# Altium project SixSwitchRectifier.PrjPcb (part 1 of 2)
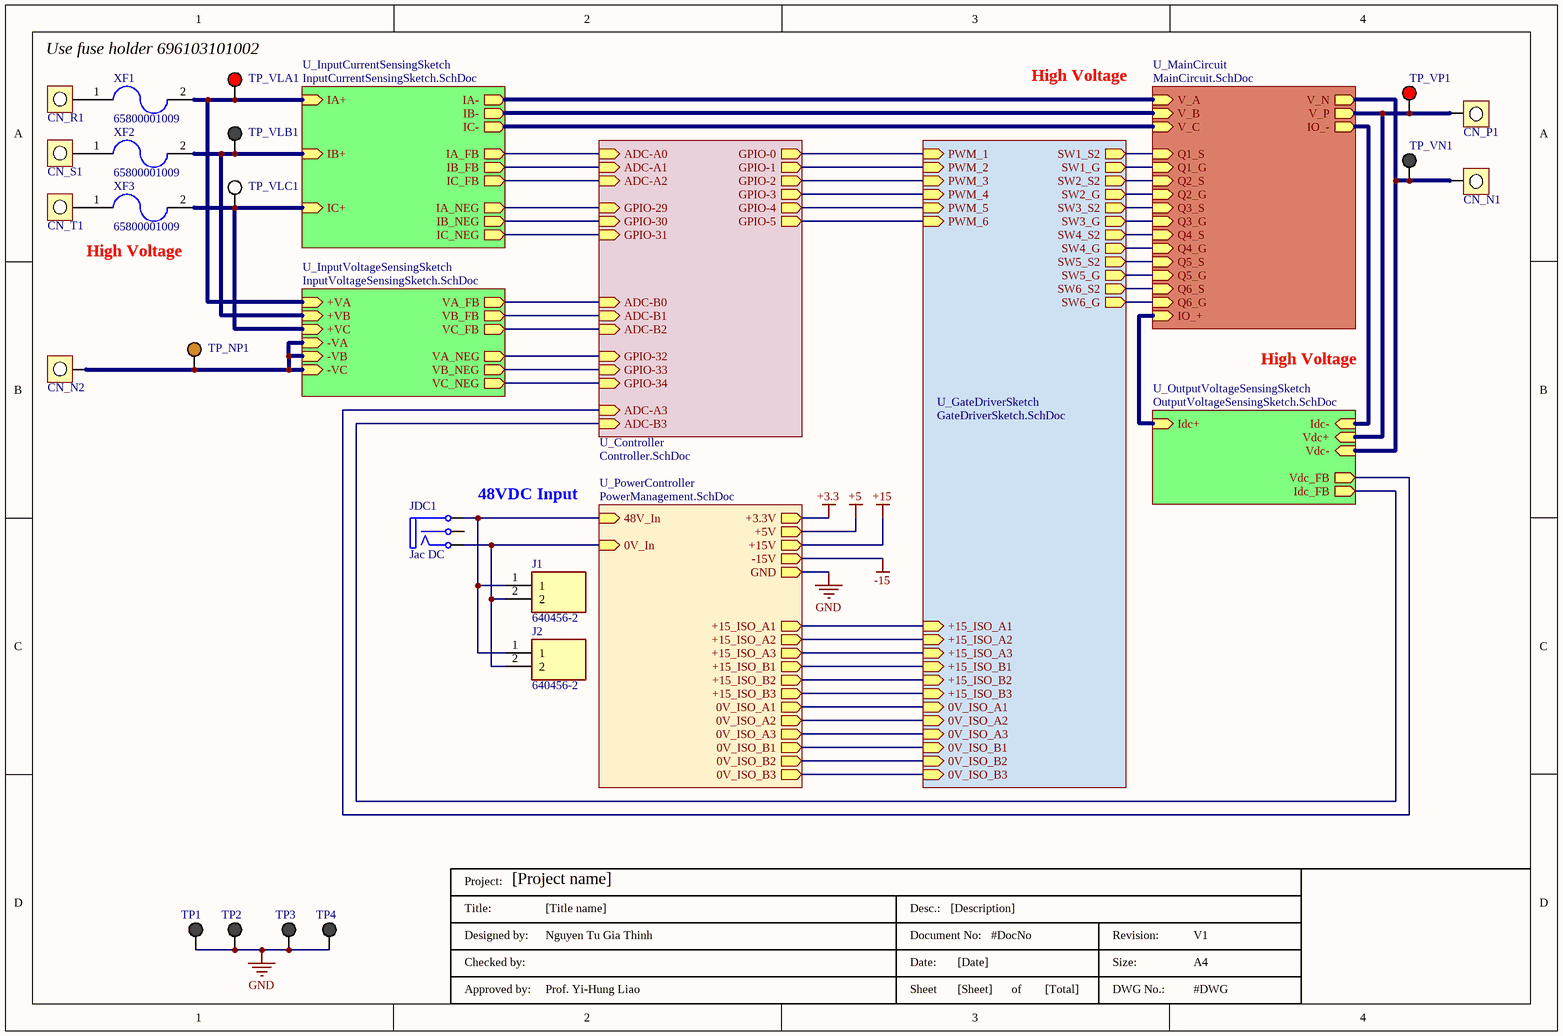
[diagram p0: CoverSheet.SchDoc]
8 sheets, 314 parts. Net scope: hierarchical (ports join the sheet entries above them; power ports are global).
Board file: SixSwitchRectifier_Board.PcbDoc
Sheets:
  CoverSheet.SchDoc
    U_PowerController = PowerManagement.SchDoc
    U_InputVoltageSensingSketch = InputVoltageSensingSketch.SchDoc
    U_InputCurrentSensingSketch = InputCurrentSensingSketch.SchDoc
    U_OutputVoltageSensingSketch = OutputVoltageSensingSketch.SchDoc
    U_GateDriverSketch = GateDriverSketch.SchDoc
    U_MainCircuit = MainCircuit.SchDoc
    U_Controller = Controller.SchDoc

## Sheet CoverSheet.SchDoc
size A4; SheetNumber: 1; SheetTotal: 8

### Parts
(Parts that share a designator on the sheet are numbered #1, #2 ... from top to bottom, then left to right.)
CN_N1  CN  [P-820W]  (value not drawn)
CN_N2  CN  [P-820W]  (value not drawn)
CN_P1  CN  [P-820W]  (value not drawn)
CN_R1  CN  [P-820W]  (value not drawn)
CN_S1  CN  [P-820W]  (value not drawn)
CN_T1  CN  [P-820W]  (value not drawn)
J1  640456-2  [SHDR2W66P0X254_1X2_508X572X1041P]
J2  640456-2  [SHDR2W66P0X254_1X2_508X572X1041P]
JDC1  Jac DC  [DC-IN]
TitleBlock#1  DWG No.: #DWG  Size:: A4  Revision:: V1  Total of Sheets: [Total]  Sheet: [Sheet]  Date:: [Date]  Document No:: #DocNo  Desc.:: [Description]  Approved by:: Prof. Yi-Hung Liao  Designed by:: Nguyen Tu Gia Thinh  Title:: [Title name]  Project: [Project name]  (hidden comment: TitleBlock)  (graphical)
TP1  (no value)  [5001]
TP2  (no value)  [5001]
TP3  (no value)  [5001]
TP4  (no value)  [5001]
TP_NP1  (no value)  [5003]
TP_VLA1  (no value)  [5000]
TP_VLB1  (no value)  [5001]
TP_VLC1  (no value)  [5002]
TP_VN1  (no value)  [5001]
TP_VP1  (no value)  [5000]
XF1  65800001009  [FUSM250108X1320N]
XF2  65800001009  [FUSM250108X1320N]
XF3  65800001009  [FUSM250108X1320N]

### Sub-sheets
U_Controller = Controller.SchDoc: ADC-A0 (in), ADC-A1 (in), ADC-A2 (in), ADC-A3 (in), GPIO-0 (out), GPIO-1 (out), GPIO-2 (out), GPIO-3 (out), GPIO-4 (out), GPIO-5 (out), ADC-B0 (in), ADC-B1 (in), ADC-B2 (in), ADC-B3 (in), GPIO-29 (in), GPIO-30 (in), GPIO-31 (in), GPIO-32 (in), GPIO-33 (in), GPIO-34 (in)
U_GateDriverSketch = GateDriverSketch.SchDoc: SW1_G (out), SW2_G (out), SW1_S2 (out), SW2_S2 (out), PWM_1 (in), PWM_2 (in), SW3_G (out), SW4_G (out), SW3_S2 (out), SW4_S2 (out), PWM_3 (in), PWM_4 (in), SW5_G (out), SW6_G (out), SW5_S2 (out), SW6_S2 (out), PWM_5 (in), PWM_6 (in), 0V_ISO_A1 (in), +15_ISO_A1 (in), +15_ISO_B1 (in), +15_ISO_A2 (in), +15_ISO_B2 (in), +15_ISO_A3 (in), +15_ISO_B3 (in), 0V_ISO_B1 (in), 0V_ISO_A2 (in), 0V_ISO_B2 (in), 0V_ISO_A3 (in), 0V_ISO_B3 (in)
U_InputCurrentSensingSketch = InputCurrentSensingSketch.SchDoc: IA- (out), IB- (out), IC- (out), IA+ (in), IB+ (in), IA_FB (out), IB_FB (out), IC_FB (out), IC+ (in), IA_NEG (out), IB_NEG (out), IC_NEG (out)
U_InputVoltageSensingSketch = InputVoltageSensingSketch.SchDoc: +VA (in), -VA (in), +VB (in), -VB (in), +VC (in), -VC (in), VA_FB (out), VB_FB (out), VC_FB (out), VA_NEG (out), VB_NEG (out), VC_NEG (out)
U_MainCircuit = MainCircuit.SchDoc: V_A (in), V_B (in), V_C (in), V_N (out), V_P (out), IO_- (out), IO_+ (in), Q1_G (in), Q2_G (in), Q3_G (in), Q6_G (in), Q5_G (in), Q4_G (in), Q1_S (in), Q2_S (in), Q3_S (in), Q6_S (in), Q5_S (in), Q4_S (in)
U_OutputVoltageSensingSketch = OutputVoltageSensingSketch.SchDoc: Vdc+ (in), Vdc- (in), Idc+ (in), Idc- (in), Vdc_FB (out), Idc_FB (out)
U_PowerController = PowerManagement.SchDoc: +15V (out), -15V (out), +3.3V (out), 48V_In (in), 0V_In (in), +5V (out), GND (out), +15_ISO_A1 (out), 0V_ISO_A1 (out), 0V_ISO_B1 (out), 0V_ISO_A2 (out), 0V_ISO_B2 (out), 0V_ISO_B3 (out), 0V_ISO_A3 (out), +15_ISO_A2 (out), +15_ISO_A3 (out), +15_ISO_B3 (out), +15_ISO_B2 (out), +15_ISO_B1 (out)

### Nets
0V_In: J1.2 J2.2 JDC1.2(TN) ; sheet U_PowerController/0V_In
0V_ISO_A1: sheet U_PowerController/0V_ISO_A1, sheet U_GateDriverSketch/SW1_S2, sheet U_GateDriverSketch/0V_ISO_A1, sheet U_MainCircuit/Q1_S
0V_ISO_A2: sheet U_PowerController/0V_ISO_A2, sheet U_GateDriverSketch/SW3_S2, sheet U_GateDriverSketch/0V_ISO_A2, sheet U_MainCircuit/Q3_S
0V_ISO_A3: sheet U_PowerController/0V_ISO_A3, sheet U_GateDriverSketch/SW5_S2, sheet U_GateDriverSketch/0V_ISO_A3, sheet U_MainCircuit/Q5_S
0V_ISO_B1: sheet U_PowerController/0V_ISO_B1, sheet U_GateDriverSketch/SW2_S2, sheet U_GateDriverSketch/0V_ISO_B1, sheet U_MainCircuit/Q2_S
0V_ISO_B2: sheet U_PowerController/0V_ISO_B2, sheet U_GateDriverSketch/SW4_S2, sheet U_GateDriverSketch/0V_ISO_B2, sheet U_MainCircuit/Q4_S
0V_ISO_B3: sheet U_PowerController/0V_ISO_B3, sheet U_GateDriverSketch/SW6_S2, sheet U_GateDriverSketch/0V_ISO_B3, sheet U_MainCircuit/Q6_S
+15_ISO_A1: sheet U_PowerController/+15_ISO_A1, sheet U_GateDriverSketch/+15_ISO_A1
+15_ISO_A3: sheet U_PowerController/+15_ISO_A3, sheet U_GateDriverSketch/+15_ISO_A3
+15_ISO_B1: sheet U_PowerController/+15_ISO_B1, sheet U_GateDriverSketch/+15_ISO_B1
+15_ISO_B2: sheet U_PowerController/+15_ISO_B2, sheet U_GateDriverSketch/+15_ISO_B2
+15_ISO_B3: sheet U_PowerController/+15_ISO_B3, sheet U_GateDriverSketch/+15_ISO_B3
+48V_In: J1.1 J2.1 JDC1.1(T) ; sheet U_PowerController/48V_In
GND: TP1.1 TP2.1 TP3.1 TP4.1 ; sheet U_PowerController/GND
ADC-A0: sheet U_InputCurrentSensingSketch/IA_FB, sheet U_Controller/ADC-A0
ADC-A1: sheet U_InputCurrentSensingSketch/IB_FB, sheet U_Controller/ADC-A1
ADC-A2: sheet U_InputCurrentSensingSketch/IC_FB, sheet U_Controller/ADC-A2
ADC-A3: sheet U_OutputVoltageSensingSketch/Vdc_FB, sheet U_Controller/ADC-A3
ADC-B0: sheet U_InputVoltageSensingSketch/VA_FB, sheet U_Controller/ADC-B0
ADC-B1: sheet U_InputVoltageSensingSketch/VB_FB, sheet U_Controller/ADC-B1
ADC-B2: sheet U_InputVoltageSensingSketch/VC_FB, sheet U_Controller/ADC-B2
ADC-B3: sheet U_OutputVoltageSensingSketch/Idc_FB, sheet U_Controller/ADC-B3
GPIO-0: sheet U_GateDriverSketch/PWM_1, sheet U_Controller/GPIO-0
GPIO-1: sheet U_GateDriverSketch/PWM_2, sheet U_Controller/GPIO-1
GPIO-2: sheet U_GateDriverSketch/PWM_3, sheet U_Controller/GPIO-2
GPIO-3: sheet U_GateDriverSketch/PWM_4, sheet U_Controller/GPIO-3
GPIO-4: sheet U_GateDriverSketch/PWM_5, sheet U_Controller/GPIO-4
GPIO-5: sheet U_GateDriverSketch/PWM_6, sheet U_Controller/GPIO-5
GPIO-29: sheet U_InputCurrentSensingSketch/IA_NEG, sheet U_Controller/GPIO-29
GPIO-30: sheet U_InputCurrentSensingSketch/IB_NEG, sheet U_Controller/GPIO-30
GPIO-31: sheet U_InputCurrentSensingSketch/IC_NEG, sheet U_Controller/GPIO-31
GPIO-32: sheet U_InputVoltageSensingSketch/VA_NEG, sheet U_Controller/GPIO-32
GPIO-33: sheet U_InputVoltageSensingSketch/VB_NEG, sheet U_Controller/GPIO-33
GPIO-34: sheet U_InputVoltageSensingSketch/VC_NEG, sheet U_Controller/GPIO-34
NetC36_1: sheet U_PowerController/+15_ISO_A2, sheet U_GateDriverSketch/+15_ISO_A2
NetC47_1: sheet U_OutputVoltageSensingSketch/Idc+, sheet U_MainCircuit/IO_+
NetC47_2: CN_N1.1 TP_VN1.1 ; sheet U_OutputVoltageSensingSketch/Vdc-, sheet U_MainCircuit/V_N
NetCN_N2_1: CN_N2.1 TP_NP1.1 ; sheet U_InputVoltageSensingSketch/-VA, sheet U_InputVoltageSensingSketch/-VB, sheet U_InputVoltageSensingSketch/-VC
NetCN_P1_1: CN_P1.1 TP_VP1.1 ; sheet U_OutputVoltageSensingSketch/Vdc+, sheet U_OutputVoltageSensingSketch/Idc-, sheet U_MainCircuit/V_P, sheet U_MainCircuit/IO_-
NetCN_R1_1: CN_R1.1 XF1.1
NetCN_S1_1: CN_S1.1 XF2.1
NetCN_T1_1: CN_T1.1 XF3.1
NetD1_2: sheet U_GateDriverSketch/SW1_G, sheet U_MainCircuit/Q1_G
NetD2_2: sheet U_GateDriverSketch/SW2_G, sheet U_MainCircuit/Q2_G
NetD3_2: sheet U_GateDriverSketch/SW3_G, sheet U_MainCircuit/Q3_G
NetD4_2: sheet U_GateDriverSketch/SW4_G, sheet U_MainCircuit/Q4_G
NetD5_2: sheet U_GateDriverSketch/SW5_G, sheet U_MainCircuit/Q5_G
NetD6_2: sheet U_GateDriverSketch/SW6_G, sheet U_MainCircuit/Q6_G
NetL10_1: sheet U_InputCurrentSensingSketch/IA-, sheet U_MainCircuit/V_A
NetL11_1: sheet U_InputCurrentSensingSketch/IB-, sheet U_MainCircuit/V_B
NetL12_1: sheet U_InputCurrentSensingSketch/IC-, sheet U_MainCircuit/V_C
NetR53_1: TP_VLA1.1 XF1.2 ; sheet U_InputVoltageSensingSketch/+VA, sheet U_InputCurrentSensingSketch/IA+
NetR66_1: TP_VLB1.1 XF2.2 ; sheet U_InputVoltageSensingSketch/+VB, sheet U_InputCurrentSensingSketch/IB+
NetR79_1: TP_VLC1.1 XF3.2 ; sheet U_InputVoltageSensingSketch/+VC, sheet U_InputCurrentSensingSketch/IC+

Not connected (* = marked no-connect by the designer): JDC1 3(S)

### Notes on the sheet
- Use fuse holder 696103101002
- High Voltage
- (near JDC1) 48VDC Input
- (in symbol Title Block 2) Project:; Title:; Desc.:; Designed by:; Document No:; Revision:; Checked by:; Date:; Size:; Approved by:; Sheet; of; DWG No.:

### Library data of the parts
CN_N1 CN_N2 CN_P1 CN_R1 CN_S1 CN_T1 = CN: Terminal
J1 J2 = 640456-2: Connector; Manufacturer_Name: TE Connectivity; Datasheet Link: http://www.te.com/commerce/DocumentDelivery/DDEController?Action=showdoc&DocId=Customer+Drawing%7F640456%7FW3%7Fpdf%7FEnglish%7FENG_CD_640456_W3.pdf%7F640456-2; Height: 10.414mm; Manufacturer_Part_Number: 640456-2; Mouser Part Number: 571-6404562; Mouser Price/Stock: https://www.mouser.co.uk/ProductDetail/TE-Connectivity-AMP/640456-2?qs=%2F35zJ5USjomRu3EJQJgZCQ%3D%3D; Arrow Part Number: 640456-2; Arrow Price/Stock: https://www.arrow.com/en/products/640456-2/te-connectivity?utm_currency=USD&region=europe
JDC1 = DCIN: Jac DC input; Value: Jac DC
TitleBlock#1 = Title Block 2
TP1-TP4 TP_VLB1 TP_VN1 = 5001: Test Point Black, Multipurpose, TH
TP_NP1 = 5003: Test Point Orrange, Multipurpose, TH
TP_VLA1 TP_VP1 = 5000: Test Point Red, Multipurpose, TH
TP_VLC1 = 5002: Test Point White, Multipurpose, TH
XF1-XF3 = 65800001009: Hardware; Manufacturer_Name: LITTELFUSE; Datasheet Link: https://www.littelfuse.com/media?resourcetype=datasheets&itemid=7143dbe7-66cc-46d0-a668-04c7d18969fc&filename=littelfuse-fuse-block-656-datasheet; Height: 13.2mm; Manufacturer_Part_Number: 65800001009; Mouser Part Number: 576-65800001009; Mouser Price/Stock: https://www.mouser.co.uk/ProductDetail/Littelfuse/65800001009?qs=sU0fTKI0LumNKe7EsrMdwQ%3D%3D; Arrow Part Number: 65800001009; Arrow Price/Stock: https://www.arrow.com/en/products/65800001009/littelfuse?utm_currency=USD&region=nac

## Sheet PowerManagement.SchDoc
size A4; SheetNumber: 7; SheetTotal: 8
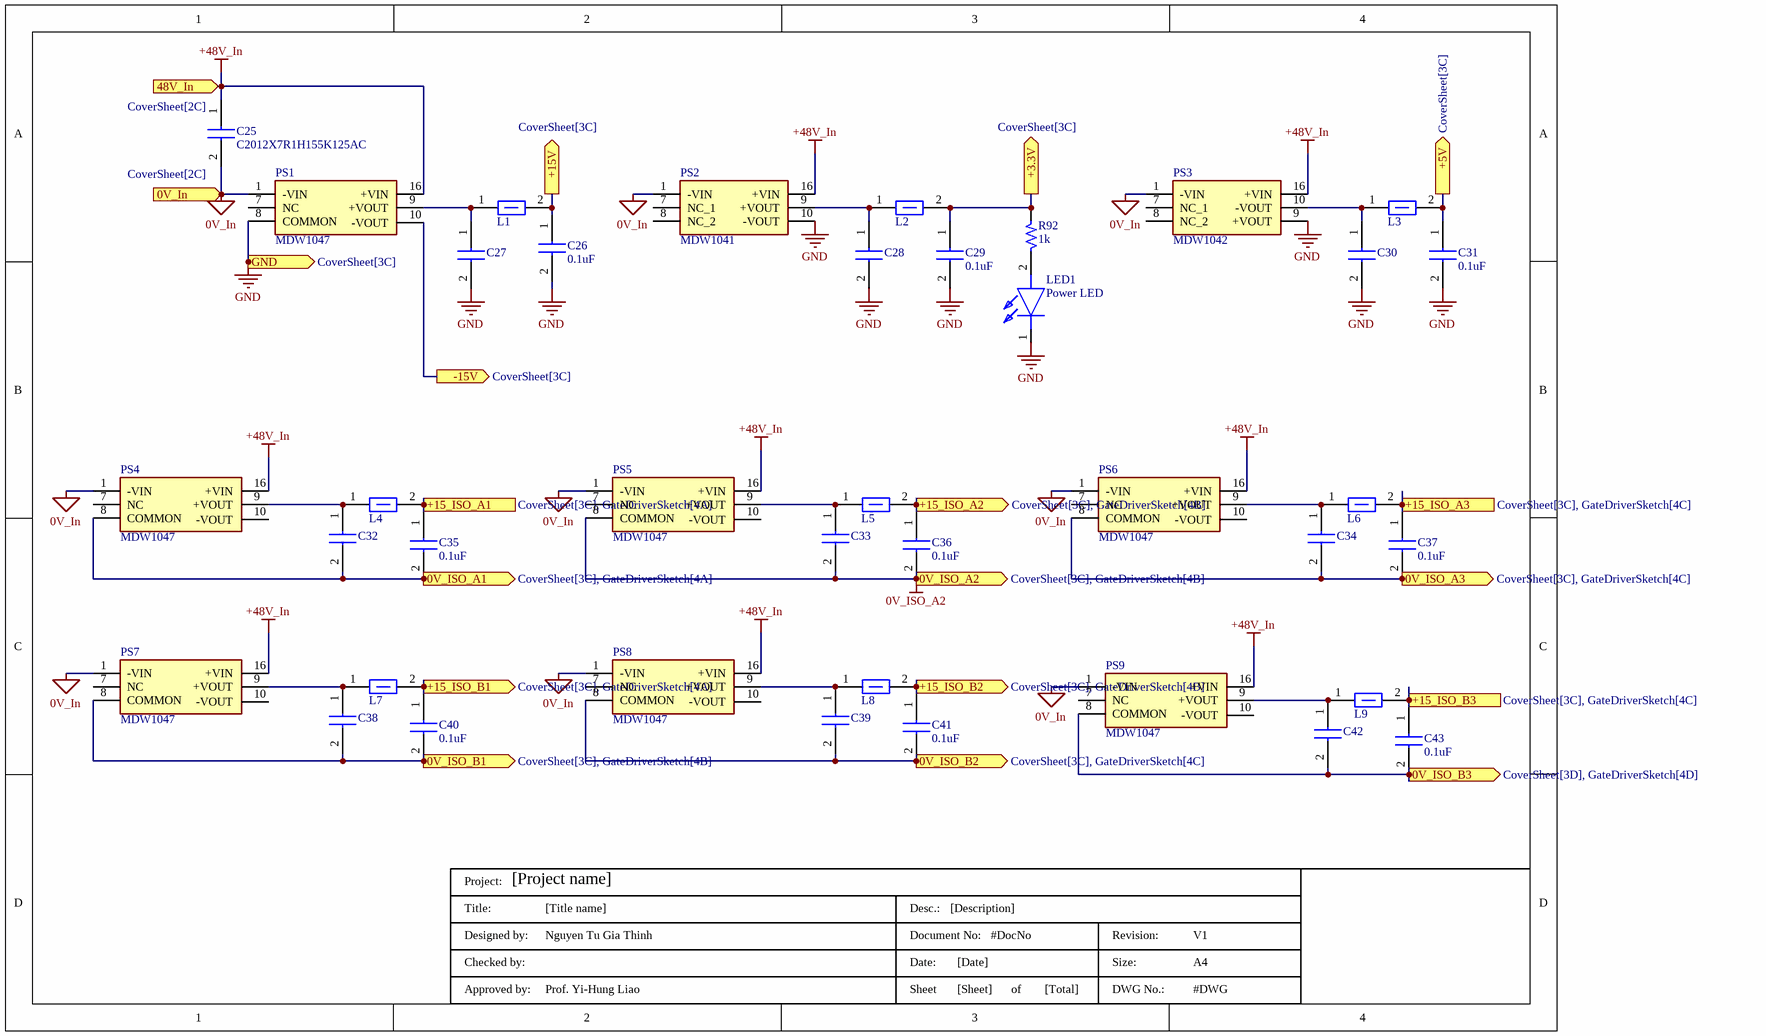
[diagram p1: PowerManagement.SchDoc]

### Parts
(Parts that share a designator on the sheet are numbered #1, #2 ... from top to bottom, then left to right.)
C25  C2012X7R1H155K125AC  [CAPC2012X145N]
C26  0.1uF  [C0805]
C27  CGA4J1X7R1E335K125AC  [CAPC2012X145N]  (value not drawn)
C28  CGA4J1X7R1E335K125AC  [CAPC2012X145N]  (value not drawn)
C29  0.1uF  [C0805]
C30  CGA4J1X7R1E335K125AC  [CAPC2012X145N]  (value not drawn)
C31  0.1uF  [C0805]
C32  CGA4J1X7R1E335K125AC  [CAPC2012X145N]  (value not drawn)
C33  CGA4J1X7R1E335K125AC  [CAPC2012X145N]  (value not drawn)
C34  CGA4J1X7R1E335K125AC  [CAPC2012X145N]  (value not drawn)
C35  0.1uF  [C0805]
C36  0.1uF  [C0805]
C37  0.1uF  [C0805]
C38  CGA4J1X7R1E335K125AC  [CAPC2012X145N]  (value not drawn)
C39  CGA4J1X7R1E335K125AC  [CAPC2012X145N]  (value not drawn)
C40  0.1uF  [C0805]
C41  0.1uF  [C0805]
C42  CGA4J1X7R1E335K125AC  [CAPC2012X145N]  (value not drawn)
C43  0.1uF  [C0805]
L1  MPZ2012S300A  [BEADC2012X105N]  (value not drawn)
L2  MPZ2012S300A  [BEADC2012X105N]  (value not drawn)
L3  MPZ2012S300A  [BEADC2012X105N]  (value not drawn)
L4  MPZ2012S300A  [BEADC2012X105N]  (value not drawn)
L5  MPZ2012S300A  [BEADC2012X105N]  (value not drawn)
L6  MPZ2012S300A  [BEADC2012X105N]  (value not drawn)
L7  MPZ2012S300A  [BEADC2012X105N]  (value not drawn)
L8  MPZ2012S300A  [BEADC2012X105N]  (value not drawn)
L9  MPZ2012S300A  [BEADC2012X105N]  (value not drawn)
LED1  Power LED  [LEDC2012X80N]
PS1  MDW1047  [MDEU0205D12HI]
PS2  MDW1041  [MDEU0205D12HI]
PS3  MDW1042  [MDEU0205D12HI]
PS4  MDW1047  [MDEU0205D12HI]
PS5  MDW1047  [MDEU0205D12HI]
PS6  MDW1047  [MDEU0205D12HI]
PS7  MDW1047  [MDEU0205D12HI]
PS8  MDW1047  [MDEU0205D12HI]
PS9  MDW1047  [MDEU0205D12HI]
R92  1k  [SM-1206]
TitleBlock#2  DWG No.: #DWG  Size:: A4  Revision:: V1  Total of Sheets: [Total]  Sheet: [Sheet]  Date:: [Date]  Document No:: #DocNo  Desc.:: [Description]  Approved by:: Prof. Yi-Hung Liao  Designed by:: Nguyen Tu Gia Thinh  Title:: [Title name]  Project: [Project name]  (hidden comment: TitleBlock)  (graphical)

### Ports
0V_In (in, see CoverSheet[2C]), 0V_ISO_A1 (out, see CoverSheet[3C], GateDriverSketch[4A]), 0V_ISO_A2 (out, see CoverSheet[3C], GateDriverSketch[4B]), 0V_ISO_A3 (out, see CoverSheet[3C], GateDriverSketch[4C]), 0V_ISO_B1 (out, see CoverSheet[3C], GateDriverSketch[4B]), 0V_ISO_B2 (out, see CoverSheet[3C], GateDriverSketch[4C]), 0V_ISO_B3 (out, see CoverSheet[3D], GateDriverSketch[4D]), 48V_In (in, see CoverSheet[2C]), +3.3V (out, see CoverSheet[3C]), +5V (out, see CoverSheet[3C]), +15_ISO_A1 (out, see CoverSheet[3C], GateDriverSketch[4A]), +15_ISO_A2 (out, see CoverSheet[3C], GateDriverSketch[4B]), +15_ISO_A3 (out, see CoverSheet[3C], GateDriverSketch[4C]), +15_ISO_B1 (out, see CoverSheet[3C], GateDriverSketch[4A]), +15_ISO_B2 (out, see CoverSheet[3C], GateDriverSketch[4B]), +15_ISO_B3 (out, see CoverSheet[3C], GateDriverSketch[4C]), +15V (out, see CoverSheet[3C]), -15V (out, see CoverSheet[3C]), GND (out, see CoverSheet[3C])

### Nets
0V_In: C25.2 PS1.1(-VIN) PS2.1(-VIN) PS3.1(-VIN) PS4.1(-VIN) PS5.1(-VIN) PS6.1(-VIN) PS7.1(-VIN) PS8.1(-VIN) PS9.1(-VIN) ; port 0V_In
0V_ISO_A1: C32.2 C35.2 PS4.8(COMMON) ; port 0V_ISO_A1
0V_ISO_A2: C33.2 C36.2 PS5.8(COMMON) ; port 0V_ISO_A2
0V_ISO_A3: C34.2 C37.2 PS6.8(COMMON) ; port 0V_ISO_A3
0V_ISO_B1: C38.2 C40.2 PS7.8(COMMON) ; port 0V_ISO_B1
0V_ISO_B2: C39.2 C41.2 PS8.8(COMMON) ; port 0V_ISO_B2
0V_ISO_B3: C42.2 C43.2 PS9.8(COMMON) ; port 0V_ISO_B3
+3.3: C29.1 L2.2 R92.2 ; port +3.3V
+5: C31.1 L3.2 ; port +5V
+15: C26.1 L1.2 ; port +15V
+15_ISO_A1: C35.1 L4.2 ; port +15_ISO_A1
+15_ISO_A3: C37.1 L6.2 ; port +15_ISO_A3
+15_ISO_B1: C40.1 L7.2 ; port +15_ISO_B1
+15_ISO_B2: C41.1 L8.2 ; port +15_ISO_B2
+15_ISO_B3: C43.1 L9.2 ; port +15_ISO_B3
+48V_In: C25.1 PS1.16(+VIN) PS2.16(+VIN) PS3.16(+VIN) PS4.16(+VIN) PS5.16(+VIN) PS6.16(+VIN) PS7.16(+VIN) PS8.16(+VIN) PS9.16(+VIN) ; port 48V_In
-15: PS1.10(-VOUT) ; port -15V
GND: C26.2 C27.2 C28.2 C29.2 C30.2 C31.2 LED1.1(K) PS1.8(COMMON) PS2.10(-VOUT) PS3.9(+VOUT) ; port GND
NetC27_1: C27.1 L1.1 PS1.9(+VOUT)
NetC28_1: C28.1 L2.1 PS2.9(+VOUT)
NetC30_1: C30.1 L3.1 PS3.10(-VOUT)
NetC32_1: C32.1 L4.1 PS4.9(+VOUT)
NetC33_1: C33.1 L5.1 PS5.9(+VOUT)
NetC34_1: C34.1 L6.1 PS6.9(+VOUT)
NetC36_1: C36.1 L5.2 ; port +15_ISO_A2
NetC38_1: C38.1 L7.1 PS7.9(+VOUT)
NetC39_1: C39.1 L8.1 PS8.9(+VOUT)
NetC42_1: C42.1 L9.1 PS9.9(+VOUT)
NetLED1_2: LED1.2(A) R92.1

Not connected (* = marked no-connect by the designer): PS1 7(NC); PS2 7(NC_1) 8(NC_2); PS3 7(NC_1) 8(NC_2); PS4 7(NC) 10(-VOUT); PS5 7(NC) 10(-VOUT); PS6 7(NC) 10(-VOUT); PS7 7(NC) 10(-VOUT); PS8 7(NC) 10(-VOUT); PS9 7(NC) 10(-VOUT)

### Notes on the sheet
- (in symbol Title Block 2) Project:; Title:; Desc.:; Designed by:; Document No:; Revision:; Checked by:; Date:; Size:; Approved by:; Sheet; of; DWG No.:

### Library data of the parts
C25 = C2012X7R1H155K125AC: Capacitor; Manufacturer_Name: TDK; Datasheet Link: https://product.tdk.com/info/en/catalog/datasheets/mlcc_commercial_midvoltage_en.pdf; Height: 1.45mm; Manufacturer_Part_Number: C2012X7R1H155K125AC; Mouser Part Number: 810-C2012X7R1H155K; Mouser Price/Stock: https://www.mouser.co.uk/ProductDetail/TDK/C2012X7R1H155K125AC?qs=LcTL%2F5vFEzHRlIjTTCHR6Q%3D%3D; Arrow Part Number: C2012X7R1H155K125AC; Arrow Price/Stock: https://www.arrow.com/en/products/c2012x7r1h155k125ac/tdk
C26 C29 C31 C35-C37 C40 C41 C43 = C0805C104K3RACTU: Capacitor; Manufacturer_Name: KEMET; Datasheet Link: https://content.kemet.com/datasheets/KEM_C1002_X7R_SMD.pdf; Height: 1.1mm; Manufacturer_Part_Number: C0805C104K3RACTU; Mouser Part Number: 80-C0805C104K3R; Mouser Price/Stock: https://www.mouser.co.uk/ProductDetail/KEMET/C0805C104K3RACTU?qs=zZwvocWqSRjmUvfNxkIN%2Fg%3D%3D; Arrow Part Number: C0805C104K3RACTU; Arrow Price/Stock: https://www.arrow.com/en/products/c0805c104k3ractu/kemet-corporation; Capacitance: 0.1uF
C27 C28 C30 C32-C34 C38 C39 C42 = CGA4J1X7R1E335K125AC: Capacitor; Manufacturer_Name: TDK; Datasheet Link: http://docs-europe.electrocomponents.com/webdocs/14e9/0900766b814e9125.pdf; Height: 1.45mm; Manufacturer_Part_Number: CGA4J1X7R1E335K125AC; Mouser Part Number: 810-CGA4J1X7R1E335K; Mouser Price/Stock: https://www.mouser.co.uk/ProductDetail/TDK/CGA4J1X7R1E335K125AC?qs=NRhsANhppD9izo%2FI14TTIw%3D%3D; Arrow Part Number: CGA4J1X7R1E335K125AC; Arrow Price/Stock: https://www.arrow.com/en/products/cga4j1x7r1e335k125ac/tdk?region=nac
L1-L9 = MPZ2012S300A: Ferrite Bead; Manufacturer_Name: TDK; Datasheet Link: https://product.tdk.com/en/system/files?file=dam/doc/product/emc/emc/beads/catalog/beads_commercial_power_mpz2012_en.pdf; Height: 1.05mm; Manufacturer_Part_Number: MPZ2012S300A; Mouser Part Number: 810-MPZ2012S300A; Mouser Price/Stock: https://www.mouser.co.uk/ProductDetail/TDK/MPZ2012S300A?qs=rDWgVMYKtcPBZp31uUan%2FA%3D%3D
LED1 = 150080VS75000: LED; Manufacturer_Name: Wurth Elektronik; Datasheet Link: http://katalog.we-online.com/led/datasheet/150080VS75000.pdf; Height: 0.8mm; Manufacturer_Part_Number: 150080VS75000; Mouser Part Number: 710-150080VS75000; Mouser Price/Stock: https://www.mouser.co.uk/ProductDetail/Wurth-Elektronik/150080VS75000?qs=LlUlMxKIyB0tGHJmO6%252B0ug%3D%3D
PS1 PS4-PS9 = MDW1047: Power Supply; Manufacturer_Name: Minmax; Datasheet Link: https://www.minmaxpower.com/storage/media/Product-MINMAX/MDW1000/MDW1000_Datasheet.pdf; Height: 8.5mm; Manufacturer_Part_Number: MDW1047
PS2 = MDW1041: Power Supply; Manufacturer_Name: Minmax; Datasheet Link: https://www.minmaxpower.com/storage/media/Product-MINMAX/MDW1000/MDW1000_Datasheet.pdf; Height: 8.5mm; Manufacturer_Part_Number: MDW1041
PS3 = MDW1042: Power Supply; Manufacturer_Name: Minmax; Datasheet Link: https://www.minmaxpower.com/storage/media/Product-MINMAX/MDW1000/MDW1000_Datasheet.pdf; Height: 8.5mm; Manufacturer_Part_Number: MDW1042
R92 = R: Resistor 1/4W; Value: R1/4W - 1K
TitleBlock#2 = Title Block 2

## Sheet InputVoltageSensingSketch.SchDoc
size A4; SheetNumber: 5; SheetTotal: 8
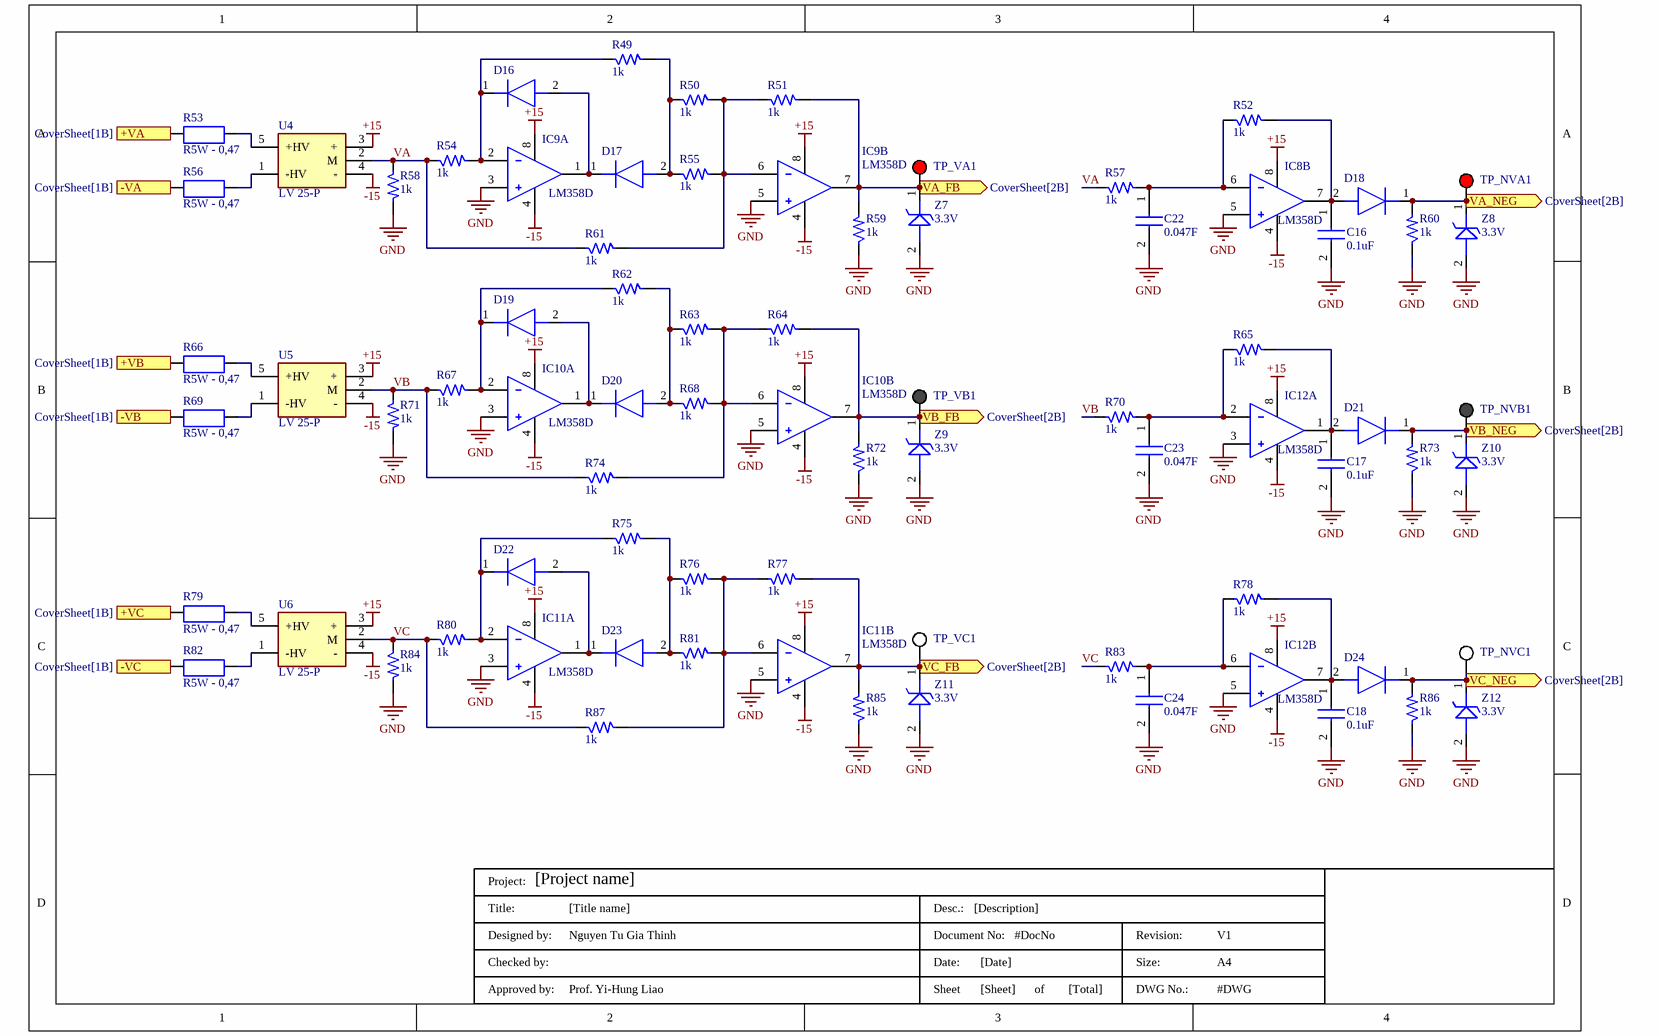
[diagram p2: InputVoltageSensingSketch.SchDoc]

### Parts
(Parts that share a designator on the sheet are numbered #1, #2 ... from top to bottom, then left to right.)
C16  0.1uF  [C0805]
C17  0.1uF  [C0805]
C18  0.1uF  [C0805]
C22  value 0.047F  [C0805]  (hidden comment: C0805C473F3GECAUTO7210)
C23  value 0.047F  [C0805]  (hidden comment: C0805C473F3GECAUTO7210)
C24  value 0.047F  [C0805]  (hidden comment: C0805C473F3GECAUTO7210)
D16  MBRM130LT1G  [MBRM130LT1G]  (value not drawn)
D17  MBRM130LT1G  [MBRM130LT1G]  (value not drawn)
D18  MBRM130LT1G  [MBRM130LT1G]  (value not drawn)
D19  MBRM130LT1G  [MBRM130LT1G]  (value not drawn)
D20  MBRM130LT1G  [MBRM130LT1G]  (value not drawn)
D21  MBRM130LT1G  [MBRM130LT1G]  (value not drawn)
D22  MBRM130LT1G  [MBRM130LT1G]  (value not drawn)
D23  MBRM130LT1G  [MBRM130LT1G]  (value not drawn)
D24  MBRM130LT1G  [MBRM130LT1G]  (value not drawn)
IC8  LM358D  [SOIC127P600X175-8N]  (part B of 2)
IC9  LM358D  [SOIC127P600X175-8N]  (parts A,B of 2)
IC10  LM358D  [SOIC127P600X175-8N]  (parts A,B of 2)
IC11  LM358D  [SOIC127P600X175-8N]  (parts A,B of 2)
IC12  LM358D  [SOIC127P600X175-8N]  (parts A,B of 2)
R49  1k  [SM-1206]
R50  1k  [SM-1206]
R51  1k  [SM-1206]
R52  1k  [SM-1206]
R53  R5W - 0,47  [R5WD]
R54  1k  [SM-1206]
R55  1k  [SM-1206]
R56  R5W - 0,47  [R5WD]
R57  1k  [SM-1206]
R58  1k  [SM-1206]
R59  1k  [SM-1206]
R60  1k  [SM-1206]
R61  1k  [SM-1206]
R62  1k  [SM-1206]
R63  1k  [SM-1206]
R64  1k  [SM-1206]
R65  1k  [SM-1206]
R66  R5W - 0,47  [R5WD]
R67  1k  [SM-1206]
R68  1k  [SM-1206]
R69  R5W - 0,47  [R5WD]
R70  1k  [SM-1206]
R71  1k  [SM-1206]
R72  1k  [SM-1206]
R73  1k  [SM-1206]
R74  1k  [SM-1206]
R75  1k  [SM-1206]
R76  1k  [SM-1206]
R77  1k  [SM-1206]
R78  1k  [SM-1206]
R79  R5W - 0,47  [R5WD]
R80  1k  [SM-1206]
R81  1k  [SM-1206]
R82  R5W - 0,47  [R5WD]
R83  1k  [SM-1206]
R84  1k  [SM-1206]
R85  1k  [SM-1206]
R86  1k  [SM-1206]
R87  1k  [SM-1206]
TitleBlock#3  DWG No.: #DWG  Size:: A4  Revision:: V1  Total of Sheets: [Total]  Sheet: [Sheet]  Date:: [Date]  Document No:: #DocNo  Desc.:: [Description]  Approved by:: Prof. Yi-Hung Liao  Designed by:: Nguyen Tu Gia Thinh  Title:: [Title name]  Project: [Project name]  (hidden comment: TitleBlock)  (graphical)
TP_NVA1  (no value)  [5000]
TP_NVB1  (no value)  [5001]
TP_NVC1  (no value)  [5002]
TP_VA1  (no value)  [5000]
TP_VB1  (no value)  [5001]
TP_VC1  (no value)  [5002]
U4  LV 25-P  [LV-25-P]
U5  LV 25-P  [LV-25-P]
U6  LV 25-P  [LV-25-P]
Z7  3.3V  [DIOM5226X230N]
Z8  3.3V  [DIOM5226X230N]
Z9  3.3V  [DIOM5226X230N]
Z10  3.3V  [DIOM5226X230N]
Z11  3.3V  [DIOM5226X230N]
Z12  3.3V  [DIOM5226X230N]

### Ports
+VA (in, see CoverSheet[1B]), +VB (in, see CoverSheet[1B]), +VC (in, see CoverSheet[1B]), -VA (in, see CoverSheet[1B]), -VB (in, see CoverSheet[1B]), -VC (in, see CoverSheet[1B]), VA_FB (out, see CoverSheet[2B]), VA_NEG (out, see CoverSheet[2B]), VB_FB (out, see CoverSheet[2B]), VB_NEG (out, see CoverSheet[2B]), VC_FB (out, see CoverSheet[2B]), VC_NEG (out, see CoverSheet[2B])

### Nets
+15: IC8.8(V+) IC9.8(V+) IC10.8(V+) IC11.8(V+) IC12.8(V+) U4.3(+) U5.3(+) U6.3(+)
-15: IC8.4(V-) IC9.4(V-) IC10.4(V-) IC11.4(V-) IC12.4(V-) U4.4(-) U5.4(-) U6.4(-)
GND: C16.2 C17.2 C18.2 C22.2 C23.2 C24.2 IC8.5(IN2+) IC9.3(IN1+) IC9.5(IN2+) IC10.3(IN1+) IC10.5(IN2+) IC11.3(IN1+) IC11.5(IN2+) IC12.3(IN1+) IC12.5(IN2+) R58.2 R59.1 R60.1 R71.2 R72.1 R73.1 R84.2 R85.1 R86.1 Z7.2(A) Z8.2(A) Z9.2(A) Z10.2(A) Z11.2(A) Z12.2(A)
ADC-B0: IC9.7(OUT2) R51.2 R59.2 TP_VA1.1 Z7.1(K) ; port VA_FB
ADC-B1: IC10.7(OUT2) R64.2 R72.2 TP_VB1.1 Z9.1(K) ; port VB_FB
ADC-B2: IC11.7(OUT2) R77.2 R85.2 TP_VC1.1 Z11.1(K) ; port VC_FB
GPIO-32: D18.1(K) R60.2 TP_NVA1.1 Z8.1(K) ; port VA_NEG
GPIO-33: D21.1(K) R73.2 TP_NVB1.1 Z10.1(K) ; port VB_NEG
GPIO-34: D24.1(K) R86.2 TP_NVC1.1 Z12.1(K) ; port VC_NEG
VA: R54.1 R57.1 R58.1 R61.1 U4.2(M)
VB: R67.1 R70.1 R71.1 R74.1 U5.2(M)
VC: R80.1 R83.1 R84.1 R87.1 U6.2(M)
NetC16_1: C16.1 D18.2(A) IC8.7(OUT2) R52.2
NetC17_1: C17.1 D21.2(A) IC12.1(OUT1) R65.2
NetC18_1: C18.1 D24.2(A) IC12.7(OUT2) R78.2
NetC22_1: C22.1 IC8.6(IN2-) R52.1 R57.2
NetC23_1: C23.1 IC12.2(IN1-) R65.1 R70.2
NetC24_1: C24.1 IC12.6(IN2-) R78.1 R83.2
NetCN_N2_1: R56.1 R69.1 R82.1 ; port -VA, port -VB, port -VC
NetD16_1: D16.1(K) IC9.2(IN1-) R49.1 R54.2
NetD16_2: D16.2(A) D17.1(K) IC9.1(OUT1)
NetD17_2: D17.2(A) R49.2 R50.1 R55.1
NetD19_1: D19.1(K) IC10.2(IN1-) R62.1 R67.2
NetD19_2: D19.2(A) D20.1(K) IC10.1(OUT1)
NetD20_2: D20.2(A) R62.2 R63.1 R68.1
NetD22_1: D22.1(K) IC11.2(IN1-) R75.1 R80.2
NetD22_2: D22.2(A) D23.1(K) IC11.1(OUT1)
NetD23_2: D23.2(A) R75.2 R76.1 R81.1
NetIC9_6: IC9.6(IN2-) R50.2 R51.1 R55.2 R61.2
NetIC10_6: IC10.6(IN2-) R63.2 R64.1 R68.2 R74.2
NetIC11_6: IC11.6(IN2-) R76.2 R77.1 R81.2 R87.2
NetR53_1: R53.1 ; port +VA
NetR53_2: R53.2 U4.5(+HV)
NetR56_2: R56.2 U4.1(-HV)
NetR66_1: R66.1 ; port +VB
NetR66_2: R66.2 U5.5(+HV)
NetR69_2: R69.2 U5.1(-HV)
NetR79_1: R79.1 ; port +VC
NetR79_2: R79.2 U6.5(+HV)
NetR82_2: R82.2 U6.1(-HV)

### Notes on the sheet
- (in symbol Title Block 2) Project:; Title:; Desc.:; Designed by:; Document No:; Revision:; Checked by:; Date:; Size:; Approved by:; Sheet; of; DWG No.:

### Library data of the parts
C16-C18 = C0805C104K3RACTU: Capacitor; Manufacturer_Name: KEMET; Datasheet Link: https://content.kemet.com/datasheets/KEM_C1002_X7R_SMD.pdf; Height: 1.1mm; Manufacturer_Part_Number: C0805C104K3RACTU; Mouser Part Number: 80-C0805C104K3R; Mouser Price/Stock: https://www.mouser.co.uk/ProductDetail/KEMET/C0805C104K3RACTU?qs=zZwvocWqSRjmUvfNxkIN%2Fg%3D%3D; Arrow Part Number: C0805C104K3RACTU; Arrow Price/Stock: https://www.arrow.com/en/products/c0805c104k3ractu/kemet-corporation; Capacitance: 0.1uF
C22-C24 = C0805C473F3GECAUTO7210: Capacitor; Manufacturer_Name: KEMET; Datasheet Link: https://content.kemet.com/datasheets/KEM_C1091_C0G_ESD.pdf; Height: 1.1mm; Manufacturer_Part_Number: C0805C473F3GECAUTO7210; Mouser Part Number: 80-C0805C473F3GEAULR; Mouser Price/Stock: https://www.mouser.co.uk/ProductDetail/KEMET/C0805C473F3GECAUTO7210?qs=55YtniHzbhCk%252BaMpaMvfmA%3D%3D
D16-D24 = MBRM130LT1G: Diode; Manufacturer_Name: onsemi; Datasheet Link: http://www.onsemi.com/pub/Collateral/MBRM130L-D.PDF; Manufacturer_Part_Number: MBRM130LT1G; Mouser Part Number: 863-MBRM130LT1G; Mouser Price/Stock: https://www.mouser.co.uk/ProductDetail/onsemi/MBRM130LT1G?qs=3JMERSakebrXPEmSbT3BNg%3D%3D; Arrow Part Number: MBRM130LT1G; Arrow Price/Stock: https://www.arrow.com/en/products/mbrm130lt1g/on-semiconductor?region=europe
IC8-IC12 = LM358D: Integrated Circuit; Manufacturer_Name: Texas Instruments; Datasheet Link: http://www.ti.com/lit/ds/symlink/lm358.pdf; Height: 1.75mm; Manufacturer_Part_Number: LM358D; Mouser Part Number: 595-LM358D; Mouser Price/Stock: https://www.mouser.co.uk/ProductDetail/Texas-Instruments/LM358D?qs=X1HXWTtiZ0RJBM%2FvBfVo8g%3D%3D; Arrow Part Number: LM358D; Arrow Price/Stock: https://www.arrow.com/en/products/lm358d/texas-instruments?region=nac
R49-R52 R54 R55 R57-R65 R67 R68 R70-R78 R80 R81 R83-R87 = R: Resistor 1/4W; Value: R1/4W - 1K
R53 R56 R66 R69 R79 R82 = R5W: Resistor 5W; Value: R5W - 0,47R
TitleBlock#3 = Title Block 2
TP_NVA1 TP_VA1 = 5000: Test Point Red, Multipurpose, TH
TP_NVB1 TP_VB1 = 5001: Test Point Black, Multipurpose, TH
TP_NVC1 TP_VC1 = 5002: Test Point White, Multipurpose, TH
U4-U6 = LV 25-P: Voltage Transducer 600V; Manufacturer_Name: LEM; Manufacturer_Part_Number: LV25P
Z7-Z12 = BZG05C3V3-HM3-08: Zener Diode; Manufacturer_Name: Vishay; Datasheet Link: https://www.vishay.com/doc?86135; Height: 2.3mm; Manufacturer_Part_Number: BZG05C3V3-HM3-08; Mouser Part Number: 78-BZG05C3V3-HM3-08; Mouser Price/Stock: https://www.mouser.co.uk/ProductDetail/Vishay-Semiconductors/BZG05C3V3-HM3-08?qs=W0yvOO0ixfFdOsuRX87wbg%3D%3D; Arrow Part Number: BZG05C3V3-HM3-08; Arrow Price/Stock: https://www.arrow.com/en/products/bzg05c3v3-hm3-08/vishay?region=nac

## Sheet InputCurrentSensingSketch.SchDoc
size A4; SheetNumber: 4; SheetTotal: 8
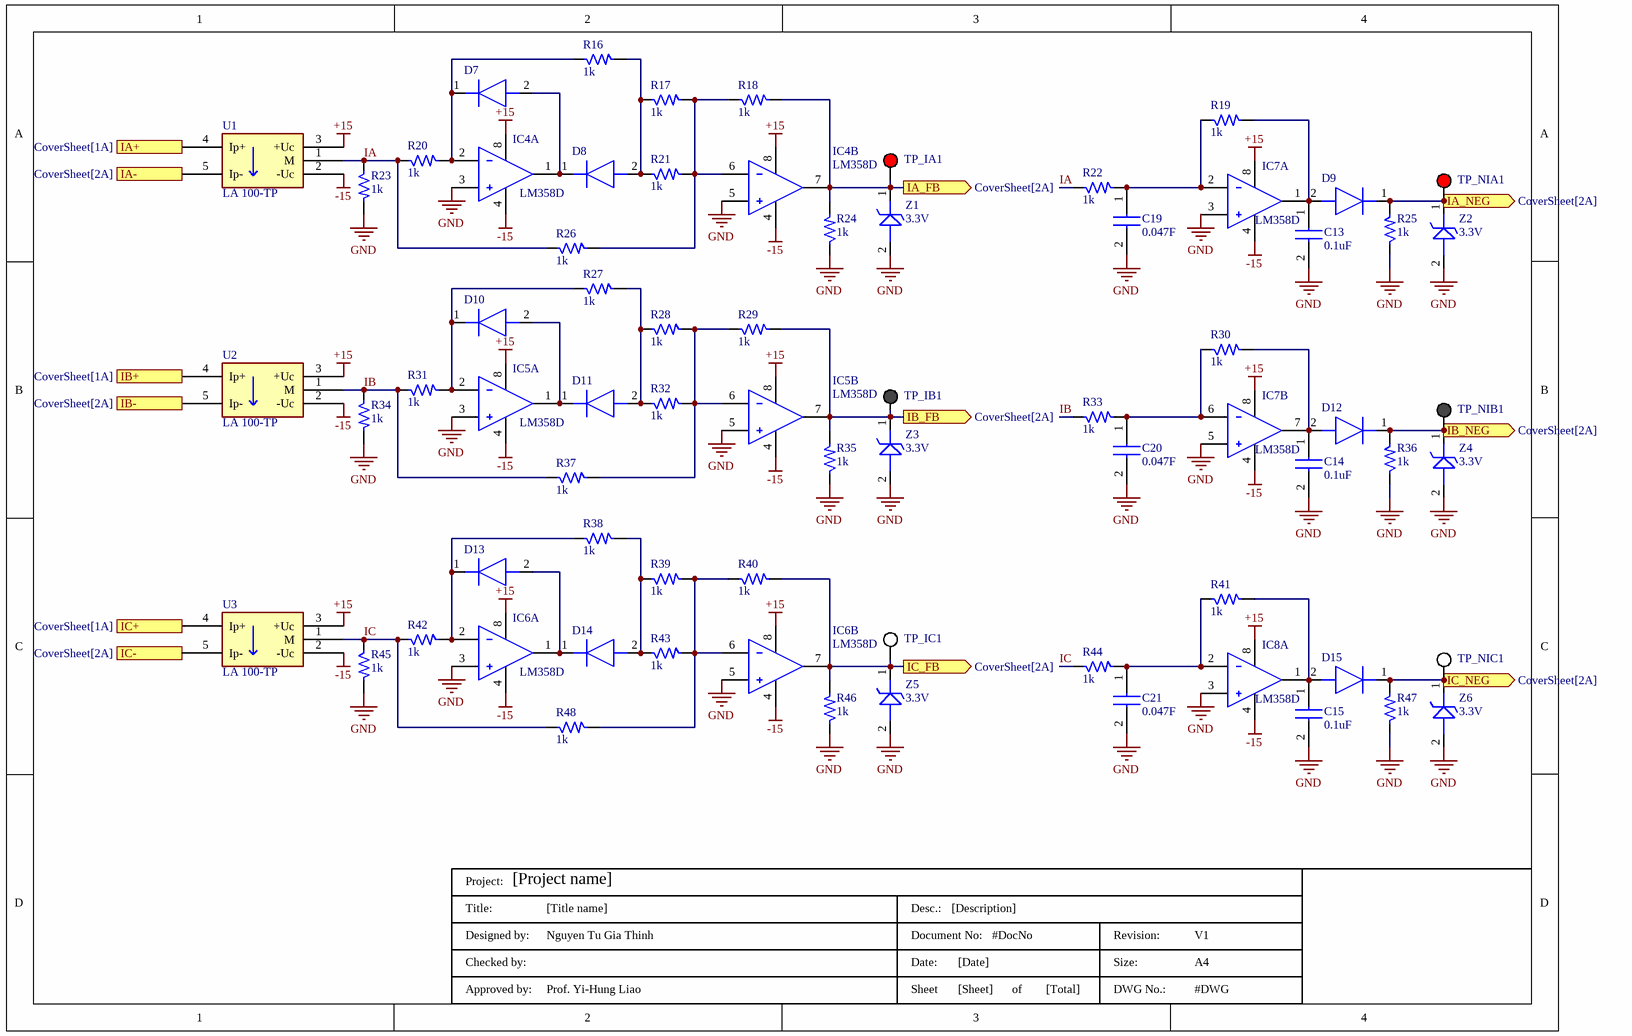
[diagram p3: InputCurrentSensingSketch.SchDoc]

### Parts
(Parts that share a designator on the sheet are numbered #1, #2 ... from top to bottom, then left to right.)
C13  0.1uF  [C0805]
C14  0.1uF  [C0805]
C15  0.1uF  [C0805]
C19  value 0.047F  [C0805]  (hidden comment: C0805C473F3GECAUTO7210)
C20  value 0.047F  [C0805]  (hidden comment: C0805C473F3GECAUTO7210)
C21  value 0.047F  [C0805]  (hidden comment: C0805C473F3GECAUTO7210)
D7  MBRM130LT1G  [MBRM130LT1G]  (value not drawn)
D8  MBRM130LT1G  [MBRM130LT1G]  (value not drawn)
D9  MBRM130LT1G  [MBRM130LT1G]  (value not drawn)
D10  MBRM130LT1G  [MBRM130LT1G]  (value not drawn)
D11  MBRM130LT1G  [MBRM130LT1G]  (value not drawn)
D12  MBRM130LT1G  [MBRM130LT1G]  (value not drawn)
D13  MBRM130LT1G  [MBRM130LT1G]  (value not drawn)
D14  MBRM130LT1G  [MBRM130LT1G]  (value not drawn)
D15  MBRM130LT1G  [MBRM130LT1G]  (value not drawn)
IC4  LM358D  [SOIC127P600X175-8N]  (parts A,B of 2)
IC5  LM358D  [SOIC127P600X175-8N]  (parts A,B of 2)
IC6  LM358D  [SOIC127P600X175-8N]  (parts A,B of 2)
IC7  LM358D  [SOIC127P600X175-8N]  (parts A,B of 2)
IC8  LM358D  [SOIC127P600X175-8N]  (part A of 2)
R16  1k  [SM-1206]
R17  1k  [SM-1206]
R18  1k  [SM-1206]
R19  1k  [SM-1206]
R20  1k  [SM-1206]
R21  1k  [SM-1206]
R22  1k  [SM-1206]
R23  1k  [SM-1206]
R24  1k  [SM-1206]
R25  1k  [SM-1206]
R26  1k  [SM-1206]
R27  1k  [SM-1206]
R28  1k  [SM-1206]
R29  1k  [SM-1206]
R30  1k  [SM-1206]
R31  1k  [SM-1206]
R32  1k  [SM-1206]
R33  1k  [SM-1206]
R34  1k  [SM-1206]
R35  1k  [SM-1206]
R36  1k  [SM-1206]
R37  1k  [SM-1206]
R38  1k  [SM-1206]
R39  1k  [SM-1206]
R40  1k  [SM-1206]
R41  1k  [SM-1206]
R42  1k  [SM-1206]
R43  1k  [SM-1206]
R44  1k  [SM-1206]
R45  1k  [SM-1206]
R46  1k  [SM-1206]
R47  1k  [SM-1206]
R48  1k  [SM-1206]
TitleBlock#4  DWG No.: #DWG  Size:: A4  Revision:: V1  Total of Sheets: [Total]  Sheet: [Sheet]  Date:: [Date]  Document No:: #DocNo  Desc.:: [Description]  Approved by:: Prof. Yi-Hung Liao  Designed by:: Nguyen Tu Gia Thinh  Title:: [Title name]  Project: [Project name]  (hidden comment: TitleBlock)  (graphical)
TP_IA1  (no value)  [5000]
TP_IB1  (no value)  [5001]
TP_IC1  (no value)  [5002]
TP_NIA1  (no value)  [5000]
TP_NIB1  (no value)  [5001]
TP_NIC1  (no value)  [5002]
U1  LA 100-TP  [LA 100-TP]
U2  LA 100-TP  [LA 100-TP]
U3  LA 100-TP  [LA 100-TP]
Z1  3.3V  [DIOM5226X230N]
Z2  3.3V  [DIOM5226X230N]
Z3  3.3V  [DIOM5226X230N]
Z4  3.3V  [DIOM5226X230N]
Z5  3.3V  [DIOM5226X230N]
Z6  3.3V  [DIOM5226X230N]

### Ports
IA+ (in, see CoverSheet[1A]), IA- (out, see CoverSheet[2A]), IA_FB (out, see CoverSheet[2A]), IA_NEG (out, see CoverSheet[2A]), IB+ (in, see CoverSheet[1A]), IB- (out, see CoverSheet[2A]), IB_FB (out, see CoverSheet[2A]), IB_NEG (out, see CoverSheet[2A]), IC+ (in, see CoverSheet[1A]), IC- (out, see CoverSheet[2A]), IC_FB (out, see CoverSheet[2A]), IC_NEG (out, see CoverSheet[2A])

### Nets
+15: IC4.8(V+) IC5.8(V+) IC6.8(V+) IC7.8(V+) IC8.8(V+) U1.3(+Uc) U2.3(+Uc) U3.3(+Uc)
-15: IC4.4(V-) IC5.4(V-) IC6.4(V-) IC7.4(V-) IC8.4(V-) U1.2(-Uc) U2.2(-Uc) U3.2(-Uc)
GND: C13.2 C14.2 C15.2 C19.2 C20.2 C21.2 IC4.3(IN1+) IC4.5(IN2+) IC5.3(IN1+) IC5.5(IN2+) IC6.3(IN1+) IC6.5(IN2+) IC7.3(IN1+) IC7.5(IN2+) IC8.3(IN1+) R23.2 R24.1 R25.1 R34.2 R35.1 R36.1 R45.2 R46.1 R47.1 Z1.2(A) Z2.2(A) Z3.2(A) Z4.2(A) Z5.2(A) Z6.2(A)
ADC-A0: IC4.7(OUT2) R18.2 R24.2 TP_IA1.1 Z1.1(K) ; port IA_FB
ADC-A1: IC5.7(OUT2) R29.2 R35.2 TP_IB1.1 Z3.1(K) ; port IB_FB
ADC-A2: IC6.7(OUT2) R40.2 R46.2 TP_IC1.1 Z5.1(K) ; port IC_FB
GPIO-29: D9.1(K) R25.2 TP_NIA1.1 Z2.1(K) ; port IA_NEG
GPIO-30: D12.1(K) R36.2 TP_NIB1.1 Z4.1(K) ; port IB_NEG
GPIO-31: D15.1(K) R47.2 TP_NIC1.1 Z6.1(K) ; port IC_NEG
IA: R20.1 R22.1 R23.1 R26.1 U1.1(M)
IB: R31.1 R33.1 R34.1 R37.1 U2.1(M)
IC: R42.1 R44.1 R45.1 R48.1 U3.1(M)
NetC13_1: C13.1 D9.2(A) IC7.1(OUT1) R19.2
NetC14_1: C14.1 D12.2(A) IC7.7(OUT2) R30.2
NetC15_1: C15.1 D15.2(A) IC8.1(OUT1) R41.2
NetC19_1: C19.1 IC7.2(IN1-) R19.1 R22.2
NetC20_1: C20.1 IC7.6(IN2-) R30.1 R33.2
NetC21_1: C21.1 IC8.2(IN1-) R41.1 R44.2
NetD7_1: D7.1(K) IC4.2(IN1-) R16.1 R20.2
NetD7_2: D7.2(A) D8.1(K) IC4.1(OUT1)
NetD8_2: D8.2(A) R16.2 R17.1 R21.1
NetD10_1: D10.1(K) IC5.2(IN1-) R27.1 R31.2
NetD10_2: D10.2(A) D11.1(K) IC5.1(OUT1)
NetD11_2: D11.2(A) R27.2 R28.1 R32.1
NetD13_1: D13.1(K) IC6.2(IN1-) R38.1 R42.2
NetD13_2: D13.2(A) D14.1(K) IC6.1(OUT1)
NetD14_2: D14.2(A) R38.2 R39.1 R43.1
NetIC4_6: IC4.6(IN2-) R17.2 R18.1 R21.2 R26.2
NetIC5_6: IC5.6(IN2-) R28.2 R29.1 R32.2 R37.2
NetIC6_6: IC6.6(IN2-) R39.2 R40.1 R43.2 R48.2
NetL10_1: U1.5(Ip-) ; port IA-
NetL11_1: U2.5(Ip-) ; port IB-
NetL12_1: U3.5(Ip-) ; port IC-
NetR53_1: U1.4(Ip+) ; port IA+
NetR66_1: U2.4(Ip+) ; port IB+
NetR79_1: U3.4(Ip+) ; port IC+

### Notes on the sheet
- (in symbol Title Block 2) Project:; Title:; Desc.:; Designed by:; Document No:; Revision:; Checked by:; Date:; Size:; Approved by:; Sheet; of; DWG No.:

### Library data of the parts
C13-C15 = C0805C104K3RACTU: Capacitor; Manufacturer_Name: KEMET; Datasheet Link: https://content.kemet.com/datasheets/KEM_C1002_X7R_SMD.pdf; Height: 1.1mm; Manufacturer_Part_Number: C0805C104K3RACTU; Mouser Part Number: 80-C0805C104K3R; Mouser Price/Stock: https://www.mouser.co.uk/ProductDetail/KEMET/C0805C104K3RACTU?qs=zZwvocWqSRjmUvfNxkIN%2Fg%3D%3D; Arrow Part Number: C0805C104K3RACTU; Arrow Price/Stock: https://www.arrow.com/en/products/c0805c104k3ractu/kemet-corporation; Capacitance: 0.1uF
C19-C21 = C0805C473F3GECAUTO7210: Capacitor; Manufacturer_Name: KEMET; Datasheet Link: https://content.kemet.com/datasheets/KEM_C1091_C0G_ESD.pdf; Height: 1.1mm; Manufacturer_Part_Number: C0805C473F3GECAUTO7210; Mouser Part Number: 80-C0805C473F3GEAULR; Mouser Price/Stock: https://www.mouser.co.uk/ProductDetail/KEMET/C0805C473F3GECAUTO7210?qs=55YtniHzbhCk%252BaMpaMvfmA%3D%3D
D7-D15 = MBRM130LT1G: Diode; Manufacturer_Name: onsemi; Datasheet Link: http://www.onsemi.com/pub/Collateral/MBRM130L-D.PDF; Manufacturer_Part_Number: MBRM130LT1G; Mouser Part Number: 863-MBRM130LT1G; Mouser Price/Stock: https://www.mouser.co.uk/ProductDetail/onsemi/MBRM130LT1G?qs=3JMERSakebrXPEmSbT3BNg%3D%3D; Arrow Part Number: MBRM130LT1G; Arrow Price/Stock: https://www.arrow.com/en/products/mbrm130lt1g/on-semiconductor?region=europe
IC4-IC8 = LM358D: as IC8 on sheet InputVoltageSensingSketch; Datasheet Link: http://www.ti.com/lit/ds/symlink/lm358.pdf; Height: 1.75mm; Manufacturer_Part_Number: LM358D; Mouser Part Number: 595-LM358D; Mouser Price/Stock: https://www.mouser.co.uk/ProductDetail/Texas-Instruments/LM358D?qs=X1HXWTtiZ0RJBM%2FvBfVo8g%3D%3D; Arrow Part Number: LM358D; Arrow Price/Stock: https://www.arrow.com/en/products/lm358d/texas-instruments?region=nac
R16-R48 = R: Resistor 1/4W; Value: R1/4W - 1K
TitleBlock#4 = Title Block 2
TP_IA1 TP_NIA1 = 5000: Test Point Red, Multipurpose, TH
TP_IB1 TP_NIB1 = 5001: Test Point Black, Multipurpose, TH
TP_IC1 TP_NIC1 = 5002: Test Point White, Multipurpose, TH
U1-U3 = LA 100-TP: Current Transducer, AC/AC, 100A
Z1-Z6 = BZG05C3V3-HM3-08: Zener Diode; Manufacturer_Name: Vishay; Datasheet Link: https://www.vishay.com/doc?86135; Height: 2.3mm; Manufacturer_Part_Number: BZG05C3V3-HM3-08; Mouser Part Number: 78-BZG05C3V3-HM3-08; Mouser Price/Stock: https://www.mouser.co.uk/ProductDetail/Vishay-Semiconductors/BZG05C3V3-HM3-08?qs=W0yvOO0ixfFdOsuRX87wbg%3D%3D; Arrow Part Number: BZG05C3V3-HM3-08; Arrow Price/Stock: https://www.arrow.com/en/products/bzg05c3v3-hm3-08/vishay?region=nac

## Sheet OutputVoltageSensingSketch.SchDoc
size A4; SheetNumber: 6; SheetTotal: 8
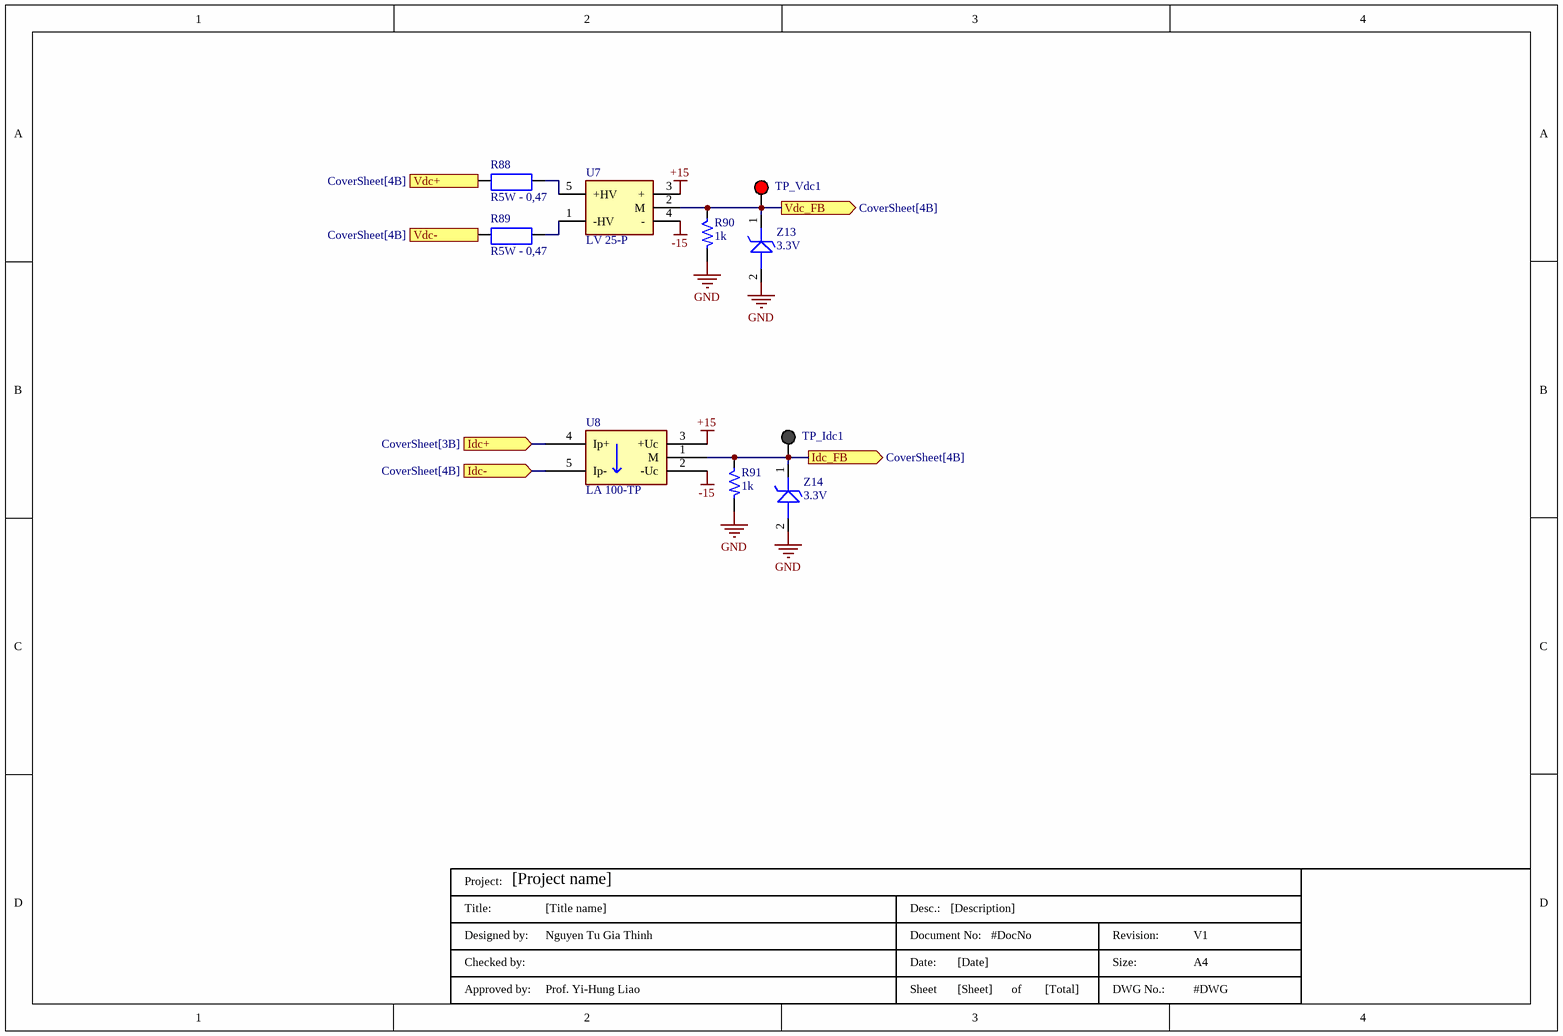
[diagram p4: OutputVoltageSensingSketch.SchDoc]

### Parts
(Parts that share a designator on the sheet are numbered #1, #2 ... from top to bottom, then left to right.)
R88  R5W - 0,47  [R5WD]
R89  R5W - 0,47  [R5WD]
R90  1k  [SM-1206]
R91  1k  [SM-1206]
TitleBlock#5  DWG No.: #DWG  Size:: A4  Revision:: V1  Total of Sheets: [Total]  Sheet: [Sheet]  Date:: [Date]  Document No:: #DocNo  Desc.:: [Description]  Approved by:: Prof. Yi-Hung Liao  Designed by:: Nguyen Tu Gia Thinh  Title:: [Title name]  Project: [Project name]  (hidden comment: TitleBlock)  (graphical)
TP_Idc1  (no value)  [5001]
TP_Vdc1  (no value)  [5000]
U7  LV 25-P  [LV-25-P]
U8  LA 100-TP  [LA 100-TP]
Z13  3.3V  [DIOM5226X230N]
Z14  3.3V  [DIOM5226X230N]

### Ports
Idc+ (in, see CoverSheet[3B]), Idc- (in, see CoverSheet[4B]), Idc_FB (out, see CoverSheet[4B]), Vdc+ (in, see CoverSheet[4B]), Vdc- (in, see CoverSheet[4B]), Vdc_FB (out, see CoverSheet[4B])

### Nets
+15: U7.3(+) U8.3(+Uc)
-15: U7.4(-) U8.2(-Uc)
GND: R90.2 R91.2 Z13.2(A) Z14.2(A)
ADC-A3: R90.1 TP_Vdc1.1 U7.2(M) Z13.1(K) ; port Vdc_FB
ADC-B3: R91.1 TP_Idc1.1 U8.1(M) Z14.1(K) ; port Idc_FB
NetC47_1: U8.4(Ip+) ; port Idc+
NetC47_2: R89.1 ; port Vdc-
NetCN_P1_1: R88.1 U8.5(Ip-) ; port Vdc+, port Idc-
NetR88_2: R88.2 U7.5(+HV)
NetR89_2: R89.2 U7.1(-HV)

### Notes on the sheet
- (in symbol Title Block 2) Project:; Title:; Desc.:; Designed by:; Document No:; Revision:; Checked by:; Date:; Size:; Approved by:; Sheet; of; DWG No.:

### Library data of the parts
R88 R89 = R5W: Resistor 5W; Value: R5W - 0,47R
R90 R91 = R: Resistor 1/4W; Value: R1/4W - 1K
TitleBlock#5 = Title Block 2
TP_Idc1 = 5001: Test Point Black, Multipurpose, TH
TP_Vdc1 = 5000: Test Point Red, Multipurpose, TH
U7 = LV 25-P: as U4 on sheet InputVoltageSensingSketch
U8 = LA 100-TP: Current Transducer, AC/AC, 100A
Z13 Z14 = BZG05C3V3-HM3-08: Zener Diode; Manufacturer_Name: Vishay; Datasheet Link: https://www.vishay.com/doc?86135; Height: 2.3mm; Manufacturer_Part_Number: BZG05C3V3-HM3-08; Mouser Part Number: 78-BZG05C3V3-HM3-08; Mouser Price/Stock: https://www.mouser.co.uk/ProductDetail/Vishay-Semiconductors/BZG05C3V3-HM3-08?qs=W0yvOO0ixfFdOsuRX87wbg%3D%3D; Arrow Part Number: BZG05C3V3-HM3-08; Arrow Price/Stock: https://www.arrow.com/en/products/bzg05c3v3-hm3-08/vishay?region=nac

## Sheet GateDriverSketch.SchDoc
size A4; SheetNumber: 3; SheetTotal: 8
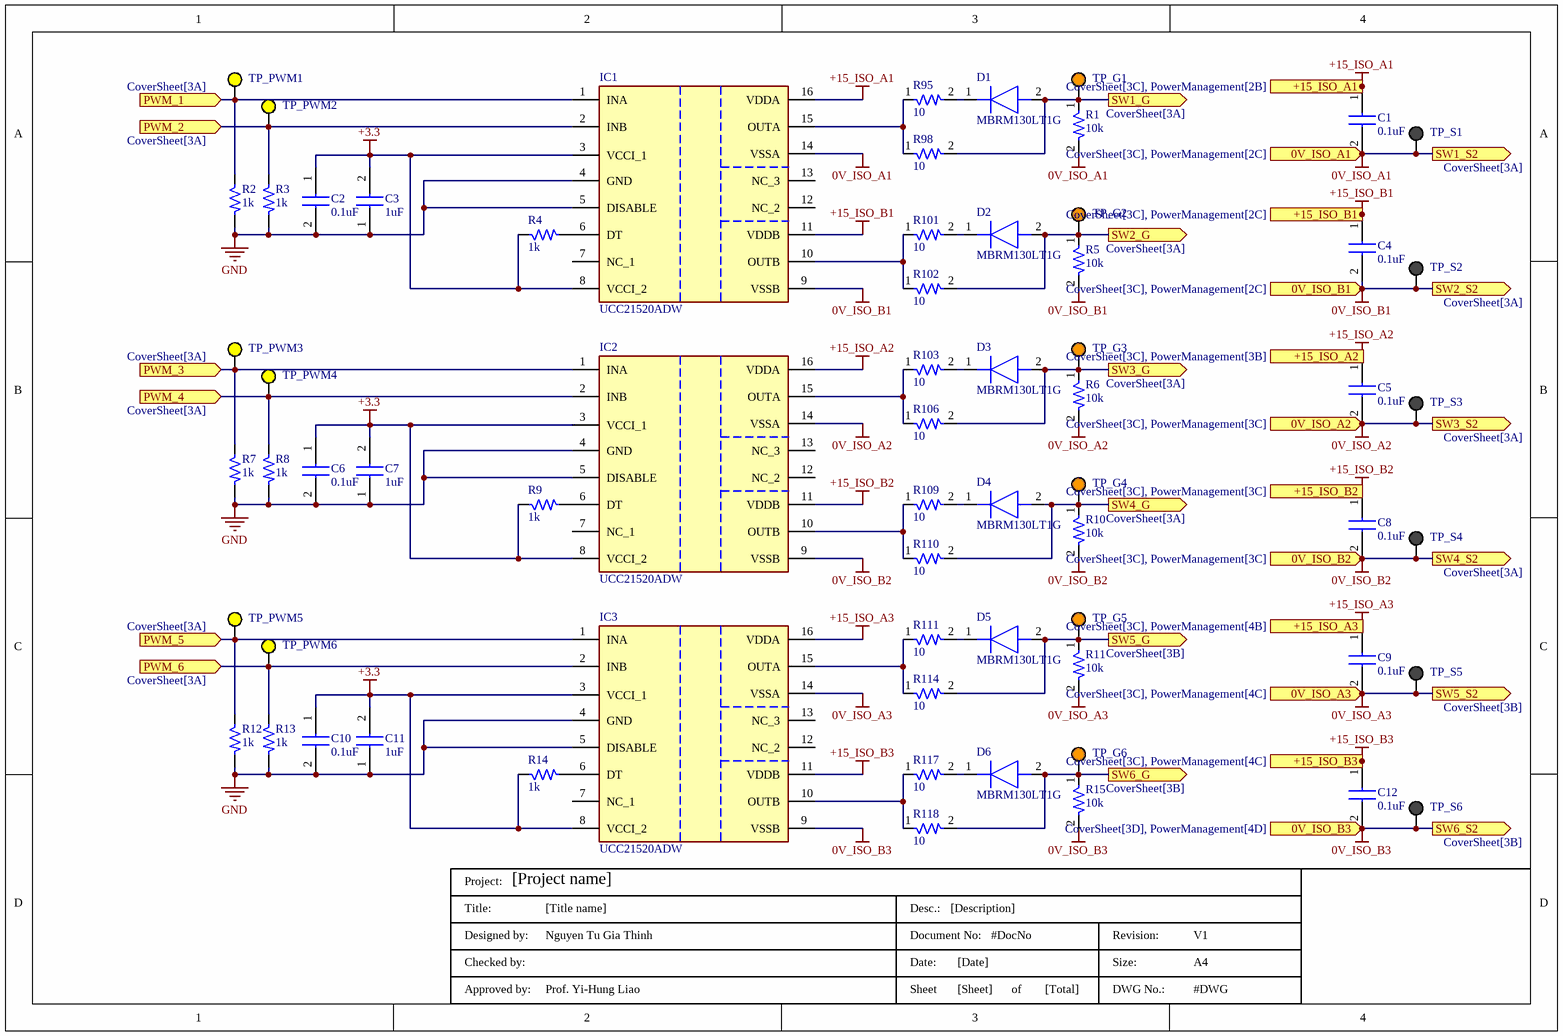
[diagram p5: GateDriverSketch.SchDoc]

### Parts
(Parts that share a designator on the sheet are numbered #1, #2 ... from top to bottom, then left to right.)
C1  0.1uF  [C0805]
C2  0.1uF  [C0805]
C3  1uF  [CAPC2012X145N]
C4  0.1uF  [C0805]
C5  0.1uF  [C0805]
C6  0.1uF  [C0805]
C7  1uF  [CAPC2012X145N]
C8  0.1uF  [C0805]
C9  0.1uF  [C0805]
C10  0.1uF  [C0805]
C11  1uF  [CAPC2012X145N]
C12  0.1uF  [C0805]
D1  MBRM130LT1G  [MBRM130LT1G]
D2  MBRM130LT1G  [MBRM130LT1G]
D3  MBRM130LT1G  [MBRM130LT1G]
D4  MBRM130LT1G  [MBRM130LT1G]
D5  MBRM130LT1G  [MBRM130LT1G]
D6  MBRM130LT1G  [MBRM130LT1G]
IC1  UCC21520ADW  [SOIC127P1030X265-16N]
IC2  UCC21520ADW  [SOIC127P1030X265-16N]
IC3  UCC21520ADW  [SOIC127P1030X265-16N]
R1  10k  [RESC2012X50N]
R2  1k  [SM-1206]
R3  1k  [SM-1206]
R4  1k  [SM-1206]
R5  10k  [RESC2012X50N]
R6  10k  [RESC2012X50N]
R7  1k  [SM-1206]
R8  1k  [SM-1206]
R9  1k  [SM-1206]
R10  10k  [RESC2012X50N]
R11  10k  [RESC2012X50N]
R12  1k  [SM-1206]
R13  1k  [SM-1206]
R14  1k  [SM-1206]
R15  10k  [RESC2012X50N]
R95  10  [RESC2012X50N]
R98  10  [RESC2012X50N]
R101  10  [RESC2012X50N]
R102  10  [RESC2012X50N]
R103  10  [RESC2012X50N]
R106  10  [RESC2012X50N]
R109  10  [RESC2012X50N]
R110  10  [RESC2012X50N]
R111  10  [RESC2012X50N]
R114  10  [RESC2012X50N]
R117  10  [RESC2012X50N]
R118  10  [RESC2012X50N]
TitleBlock#6  DWG No.: #DWG  Size:: A4  Revision:: V1  Total of Sheets: [Total]  Sheet: [Sheet]  Date:: [Date]  Document No:: #DocNo  Desc.:: [Description]  Approved by:: Prof. Yi-Hung Liao  Designed by:: Nguyen Tu Gia Thinh  Title:: [Title name]  Project: [Project name]  (hidden comment: TitleBlock)  (graphical)
TP_G1  (no value)  [5003]
TP_G2  (no value)  [5003]
TP_G3  (no value)  [5003]
TP_G4  (no value)  [5003]
TP_G5  (no value)  [5003]
TP_G6  (no value)  [5003]
TP_PWM1  (no value)  [5004]
TP_PWM2  (no value)  [5004]
TP_PWM3  (no value)  [5004]
TP_PWM4  (no value)  [5004]
TP_PWM5  (no value)  [5004]
TP_PWM6  (no value)  [5004]
TP_S1  (no value)  [5001]
TP_S2  (no value)  [5001]
TP_S3  (no value)  [5001]
TP_S4  (no value)  [5001]
TP_S5  (no value)  [5001]
TP_S6  (no value)  [5001]

### Ports
0V_ISO_A1 (in, see CoverSheet[3C], PowerManagement[2C]), 0V_ISO_A2 (in, see CoverSheet[3C], PowerManagement[3C]), 0V_ISO_A3 (in, see CoverSheet[3C], PowerManagement[4C]), 0V_ISO_B1 (in, see CoverSheet[3C], PowerManagement[2C]), 0V_ISO_B2 (in, see CoverSheet[3C], PowerManagement[3C]), 0V_ISO_B3 (in, see CoverSheet[3D], PowerManagement[4D]), +15_ISO_A1 (in, see CoverSheet[3C], PowerManagement[2B]), +15_ISO_A2 (in, see CoverSheet[3C], PowerManagement[3B]), +15_ISO_A3 (in, see CoverSheet[3C], PowerManagement[4B]), +15_ISO_B1 (in, see CoverSheet[3C], PowerManagement[2C]), +15_ISO_B2 (in, see CoverSheet[3C], PowerManagement[3C]), +15_ISO_B3 (in, see CoverSheet[3C], PowerManagement[4C]), PWM_1 (in, see CoverSheet[3A]), PWM_2 (in, see CoverSheet[3A]), PWM_3 (in, see CoverSheet[3A]), PWM_4 (in, see CoverSheet[3A]), PWM_5 (in, see CoverSheet[3A]), PWM_6 (in, see CoverSheet[3A]), SW1_G (out, see CoverSheet[3A]), SW1_S2 (out, see CoverSheet[3A]), SW2_G (out, see CoverSheet[3A]), SW2_S2 (out, see CoverSheet[3A]), SW3_G (out, see CoverSheet[3A]), SW3_S2 (out, see CoverSheet[3A]), SW4_G (out, see CoverSheet[3A]), SW4_S2 (out, see CoverSheet[3A]), SW5_G (out, see CoverSheet[3B]), SW5_S2 (out, see CoverSheet[3B]), SW6_G (out, see CoverSheet[3B]), SW6_S2 (out, see CoverSheet[3B])

### Nets
0V_ISO_A1: C1.2 IC1.14(VSSA) R1.2 TP_S1.1 ; port SW1_S2, port 0V_ISO_A1
0V_ISO_A2: C5.2 IC2.14(VSSA) R6.2 TP_S3.1 ; port SW3_S2, port 0V_ISO_A2
0V_ISO_A3: C9.2 IC3.14(VSSA) R11.2 TP_S5.1 ; port SW5_S2, port 0V_ISO_A3
0V_ISO_B1: C4.2 IC1.9(VSSB) R5.2 TP_S2.1 ; port SW2_S2, port 0V_ISO_B1
0V_ISO_B2: C8.2 IC2.9(VSSB) R10.2 TP_S4.1 ; port SW4_S2, port 0V_ISO_B2
0V_ISO_B3: C12.2 IC3.9(VSSB) R15.2 TP_S6.1 ; port SW6_S2, port 0V_ISO_B3
+15_ISO_A1: C1.1 IC1.16(VDDA) ; port +15_ISO_A1
+15_ISO_A2: C5.1 IC2.16(VDDA)
+15_ISO_A3: C9.1 IC3.16(VDDA) ; port +15_ISO_A3
+15_ISO_B1: C4.1 IC1.11(VDDB) ; port +15_ISO_B1
+15_ISO_B2: C8.1 IC2.11(VDDB) ; port +15_ISO_B2
+15_ISO_B3: C12.1 IC3.11(VDDB) ; port +15_ISO_B3
GND: C2.2 C3.1 C6.2 C7.1 C10.2 C11.1 IC1.4(GND) IC1.5(DISABLE) IC2.4(GND) IC2.5(DISABLE) IC3.4(GND) IC3.5(DISABLE) R2.2 R3.2 R7.2 R8.2 R12.2 R13.2
GPIO-0: IC1.1(INA) R2.1 TP_PWM1.1 ; port PWM_1
GPIO-1: IC1.2(INB) R3.1 TP_PWM2.1 ; port PWM_2
GPIO-2: IC2.1(INA) R7.1 TP_PWM3.1 ; port PWM_3
GPIO-3: IC2.2(INB) R8.1 TP_PWM4.1 ; port PWM_4
GPIO-4: IC3.1(INA) R12.1 TP_PWM5.1 ; port PWM_5
GPIO-5: IC3.2(INB) R13.1 TP_PWM6.1 ; port PWM_6
NetC2_1: C2.1 C3.2 IC1.3(VCCI_1) IC1.8(VCCI_2) R4.1
NetC6_1: C6.1 C7.2 IC2.3(VCCI_1) IC2.8(VCCI_2) R9.1
NetC10_1: C10.1 C11.2 IC3.3(VCCI_1) IC3.8(VCCI_2) R14.1
NetD1_1: D1.1(K) R95.2
NetD1_2: D1.2(A) R1.1 R98.2 TP_G1.1 ; port SW1_G
NetD2_1: D2.1(K) R101.2
NetD2_2: D2.2(A) R5.1 R102.2 TP_G2.1 ; port SW2_G
NetD3_1: D3.1(K) R103.2
NetD3_2: D3.2(A) R6.1 R106.2 TP_G3.1 ; port SW3_G
NetD4_1: D4.1(K) R109.2
NetD4_2: D4.2(A) R10.1 R110.2 TP_G4.1 ; port SW4_G
NetD5_1: D5.1(K) R111.2
NetD5_2: D5.2(A) R11.1 R114.2 TP_G5.1 ; port SW5_G
NetD6_1: D6.1(K) R117.2
NetD6_2: D6.2(A) R15.1 R118.2 TP_G6.1 ; port SW6_G
NetIC1_6: IC1.6(DT) R4.2
NetIC1_10: IC1.10(OUTB) R101.1 R102.1
NetIC1_15: IC1.15(OUTA) R95.1 R98.1
NetIC2_6: IC2.6(DT) R9.2
NetIC2_10: IC2.10(OUTB) R109.1 R110.1
NetIC2_15: IC2.15(OUTA) R103.1 R106.1
NetIC3_6: IC3.6(DT) R14.2
NetIC3_10: IC3.10(OUTB) R117.1 R118.1
NetIC3_15: IC3.15(OUTA) R111.1 R114.1

Not connected (* = marked no-connect by the designer): IC1 7(NC_1) 12(NC_2) 13(NC_3); IC2 7(NC_1) 12(NC_2) 13(NC_3); IC3 7(NC_1) 12(NC_2) 13(NC_3)

### Notes on the sheet
- Labels drawn without touching a wire or pin: +3.3
- (in symbol Title Block 2) Project:; Title:; Desc.:; Designed by:; Document No:; Revision:; Checked by:; Date:; Size:; Approved by:; Sheet; of; DWG No.:

### Library data of the parts
C1 C2 C4-C6 C8-C10 C12 = C0805C104K3RACTU: Capacitor; Manufacturer_Name: KEMET; Datasheet Link: https://content.kemet.com/datasheets/KEM_C1002_X7R_SMD.pdf; Height: 1.1mm; Manufacturer_Part_Number: C0805C104K3RACTU; Mouser Part Number: 80-C0805C104K3R; Mouser Price/Stock: https://www.mouser.co.uk/ProductDetail/KEMET/C0805C104K3RACTU?qs=zZwvocWqSRjmUvfNxkIN%2Fg%3D%3D; Arrow Part Number: C0805C104K3RACTU; Arrow Price/Stock: https://www.arrow.com/en/products/c0805c104k3ractu/kemet-corporation; Capacitance: 0.1uF
C3 C7 C11 = GRM21BR71H105KA12L: Capacitor; Manufacturer_Name: Murata Electronics; Datasheet Link: http://www.murata.com/~/media/webrenewal/support/library/catalog/products/capacitor/mlcc/c02e.pdf; Height: 1.45mm; Manufacturer_Part_Number: GRM21BR71H105KA12L; Mouser Part Number: 81-GRM21BR71H105KA2L; Mouser Price/Stock: https://www.mouser.co.uk/ProductDetail/Murata-Electronics/GRM21BR71H105KA12L?qs=Er06SXQpt%252B60EIT%2FJ7%2F41Q%3D%3D; Arrow Part Number: GRM21BR71H105KA12L; Arrow Price/Stock: https://www.arrow.com/en/products/grm21br71h105ka12l/murata-manufacturing
D1-D6 = MBRM130LT1G: Diode; Manufacturer_Name: onsemi; Datasheet Link: http://www.onsemi.com/pub/Collateral/MBRM130L-D.PDF; Manufacturer_Part_Number: MBRM130LT1G; Mouser Part Number: 863-MBRM130LT1G; Mouser Price/Stock: https://www.mouser.co.uk/ProductDetail/onsemi/MBRM130LT1G?qs=3JMERSakebrXPEmSbT3BNg%3D%3D; Arrow Part Number: MBRM130LT1G; Arrow Price/Stock: https://www.arrow.com/en/products/mbrm130lt1g/on-semiconductor?region=europe
IC1-IC3 = UCC21520ADW: Integrated Circuit; Manufacturer_Name: Texas Instruments; Datasheet Link: http://www.ti.com/lit/gpn/ucc21520; Height: 2.65mm; Manufacturer_Part_Number: UCC21520ADW; Mouser Part Number: 595-UCC21520ADW; Mouser Price/Stock: https://www.mouser.co.uk/ProductDetail/Texas-Instruments/UCC21520ADW?qs=%2FP2Ij7fVdhFsQr%252B%2F6P1laA%3D%3D; Arrow Part Number: UCC21520ADW; Arrow Price/Stock: https://www.arrow.com/en/products/ucc21520adw/texas-instruments?region=europe
R1 R5 R6 R10 R11 R15 R95 R98 R101-R103 R106 R109-R111 R114 R117 R118 = CRCW0805470RFKEA_1: Resistor; Manufacturer_Name: Vishay; Datasheet Link: http://www.vishay.com/docs/20035/dcrcwe3.pdf; Height: 0.5mm; Manufacturer_Part_Number: CRCW0805470RFKEA; Mouser Part Number: 71-CRCW0805-470-E3; Mouser Price/Stock: https://www.mouser.co.uk/ProductDetail/Vishay-Dale/CRCW0805470RFKEA?qs=H9nSDuxQXAFXsHHWFcTSWg%3D%3D; Arrow Part Number: CRCW0805470RFKEA; Arrow Price/Stock: https://www.arrow.com/en/products/crcw0805470rfkea/vishay
R2-R4 R7-R9 R12-R14 = R: Resistor 1/4W; Value: R1/4W - 1K
TitleBlock#6 = Title Block 2
TP_G1-TP_G6 = 5003: Test Point Orrange, Multipurpose, TH
TP_PWM1-TP_PWM6 = 5004: Test Point Yellow, Multipurpose, TH
TP_S1-TP_S6 = 5001: Test Point Black, Multipurpose, TH

## Sheet MainCircuit.SchDoc
size A4; SheetNumber: 2; SheetTotal: 8
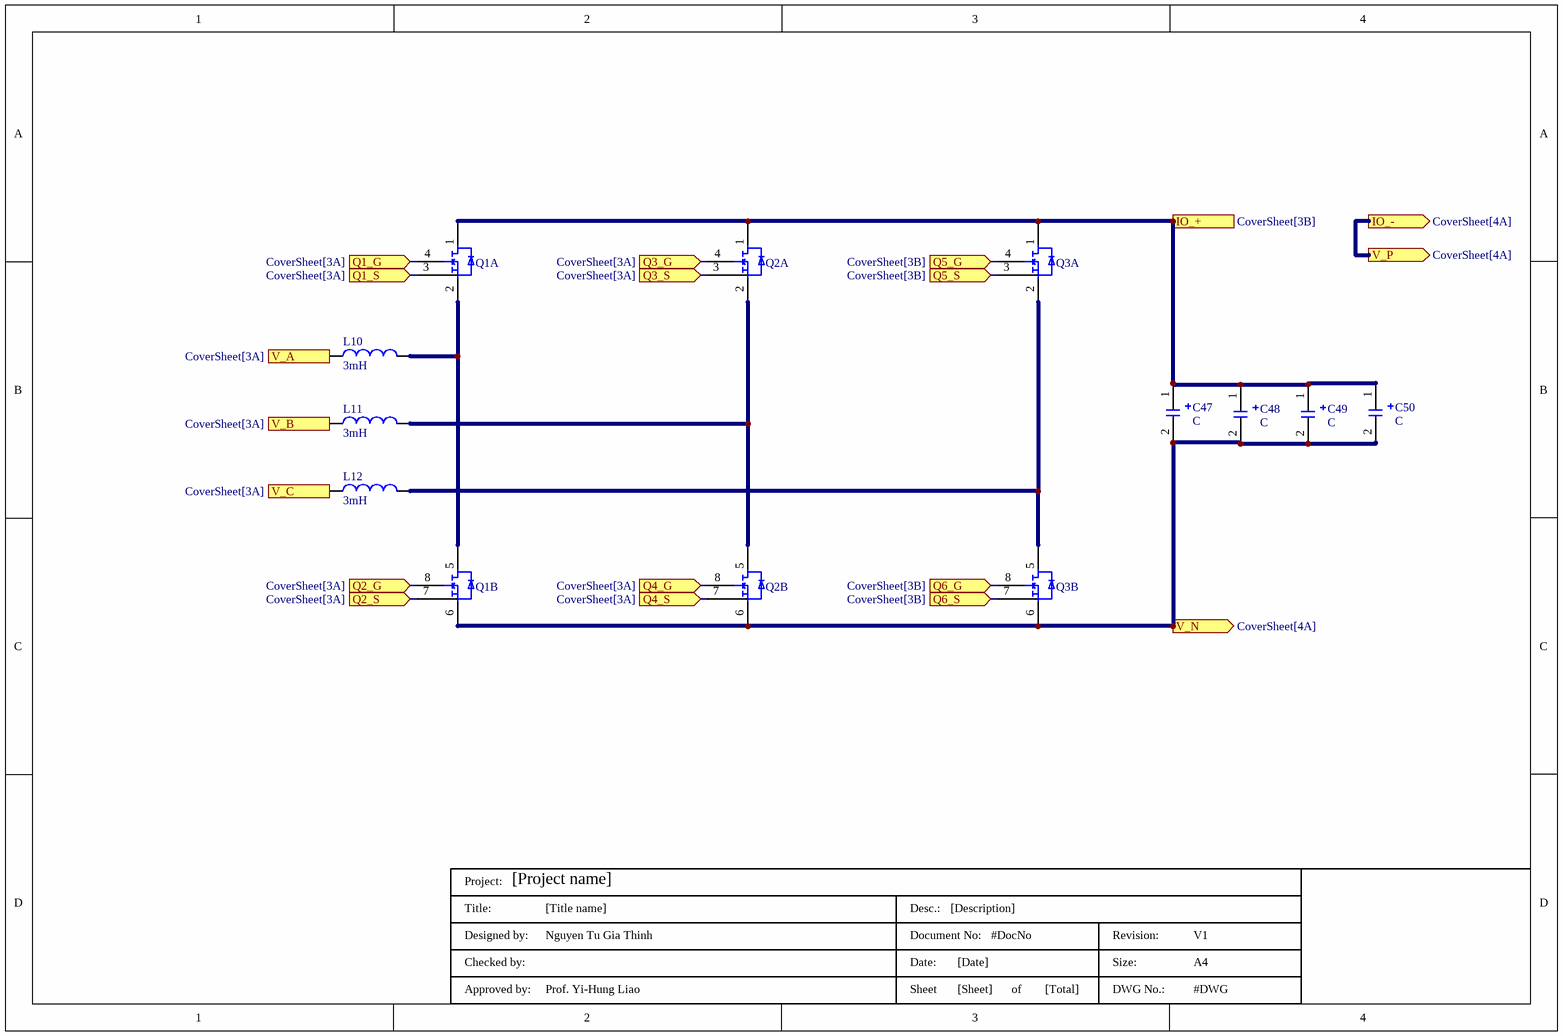
[diagram p6: MainCircuit.SchDoc]

### Parts
(Parts that share a designator on the sheet are numbered #1, #2 ... from top to bottom, then left to right.)
C47  C  [CAPACITOR]
C48  C  [CAPACITOR]
C49  C  [CAPACITOR]
C50  C  [CAPACITOR]
L10  value 3mH  [CS467125x2]  (hidden comment: Inductor)
L11  value 3mH  [CS467125x2]  (hidden comment: Inductor)
L12  value 3mH  [CS467125x2]  (hidden comment: Inductor)
Q1  SiC MOS  [C247-050-2VE]  (value not drawn)  (parts A,B of 2)
Q2  SiC MOS  [C247-050-2VE]  (value not drawn)  (parts A,B of 2)
Q3  SiC MOS  [C247-050-2VE]  (value not drawn)  (parts A,B of 2)
TitleBlock#7  DWG No.: #DWG  Size:: A4  Revision:: V1  Total of Sheets: [Total]  Sheet: [Sheet]  Date:: [Date]  Document No:: #DocNo  Desc.:: [Description]  Approved by:: Prof. Yi-Hung Liao  Designed by:: Nguyen Tu Gia Thinh  Title:: [Title name]  Project: [Project name]  (hidden comment: TitleBlock)  (graphical)

### Ports
IO_+ (in, see CoverSheet[3B]), IO_- (out, see CoverSheet[4A]), Q1_G (in, see CoverSheet[3A]), Q1_S (in, see CoverSheet[3A]), Q2_G (in, see CoverSheet[3A]), Q2_S (in, see CoverSheet[3A]), Q3_G (in, see CoverSheet[3A]), Q3_S (in, see CoverSheet[3A]), Q4_G (in, see CoverSheet[3A]), Q4_S (in, see CoverSheet[3A]), Q5_G (in, see CoverSheet[3B]), Q5_S (in, see CoverSheet[3B]), Q6_G (in, see CoverSheet[3B]), Q6_S (in, see CoverSheet[3B]), V_A (in, see CoverSheet[3A]), V_B (in, see CoverSheet[3A]), V_C (in, see CoverSheet[3A]), V_N (out, see CoverSheet[4A]), V_P (out, see CoverSheet[4A])

### Nets
0V_ISO_A1: Q1.3(S2) ; port Q1_S
0V_ISO_A2: Q2.3(S2) ; port Q3_S
0V_ISO_A3: Q3.3(S2) ; port Q5_S
0V_ISO_B1: Q1.7(S2) ; port Q2_S
0V_ISO_B2: Q2.7(S2) ; port Q4_S
0V_ISO_B3: Q3.7(S2) ; port Q6_S
NetC47_1: C47.1(+) C48.1(+) C49.1(+) C50.1(+) Q1.1(D) Q2.1(D) Q3.1(D) ; port IO_+
NetC47_2: C47.2(-) C48.2(-) C49.2(-) C50.2(-) Q1.6(S1) Q2.6(S1) Q3.6(S1) ; port V_N
NetCN_P1_1: port V_P, port IO_-
NetD1_2: Q1.4(G) ; port Q1_G
NetD2_2: Q1.8(G) ; port Q2_G
NetD3_2: Q2.4(G) ; port Q3_G
NetD4_2: Q2.8(G) ; port Q4_G
NetD5_2: Q3.4(G) ; port Q5_G
NetD6_2: Q3.8(G) ; port Q6_G
NetL10_1: L10.1 ; port V_A
NetL10_2: L10.2 Q1.2(S1) Q1.5(D)
NetL11_1: L11.1 ; port V_B
NetL11_2: L11.2 Q2.2(S1) Q2.5(D)
NetL12_1: L12.1 ; port V_C
NetL12_2: L12.2 Q3.2(S1) Q3.5(D)

### Notes on the sheet
- (in symbol Title Block 2) Project:; Title:; Desc.:; Designed by:; Document No:; Revision:; Checked by:; Date:; Size:; Approved by:; Sheet; of; DWG No.:

### Library data of the parts
L10-L12 = CS467125x2: Inductor Powder core CS467125 x2 cores, phi 1.6mm, 1 layer, 74 turns, 3mH.
Q1-Q3 = C247-050-2VE: MOSFETs, N-Channel 1200 V 100A (Tc) 431W (Tc) Through Hole TO-247-4L(X)
TitleBlock#7 = Title Block 2